# EAGLE design Z80 (EAGLE 7.2.0)
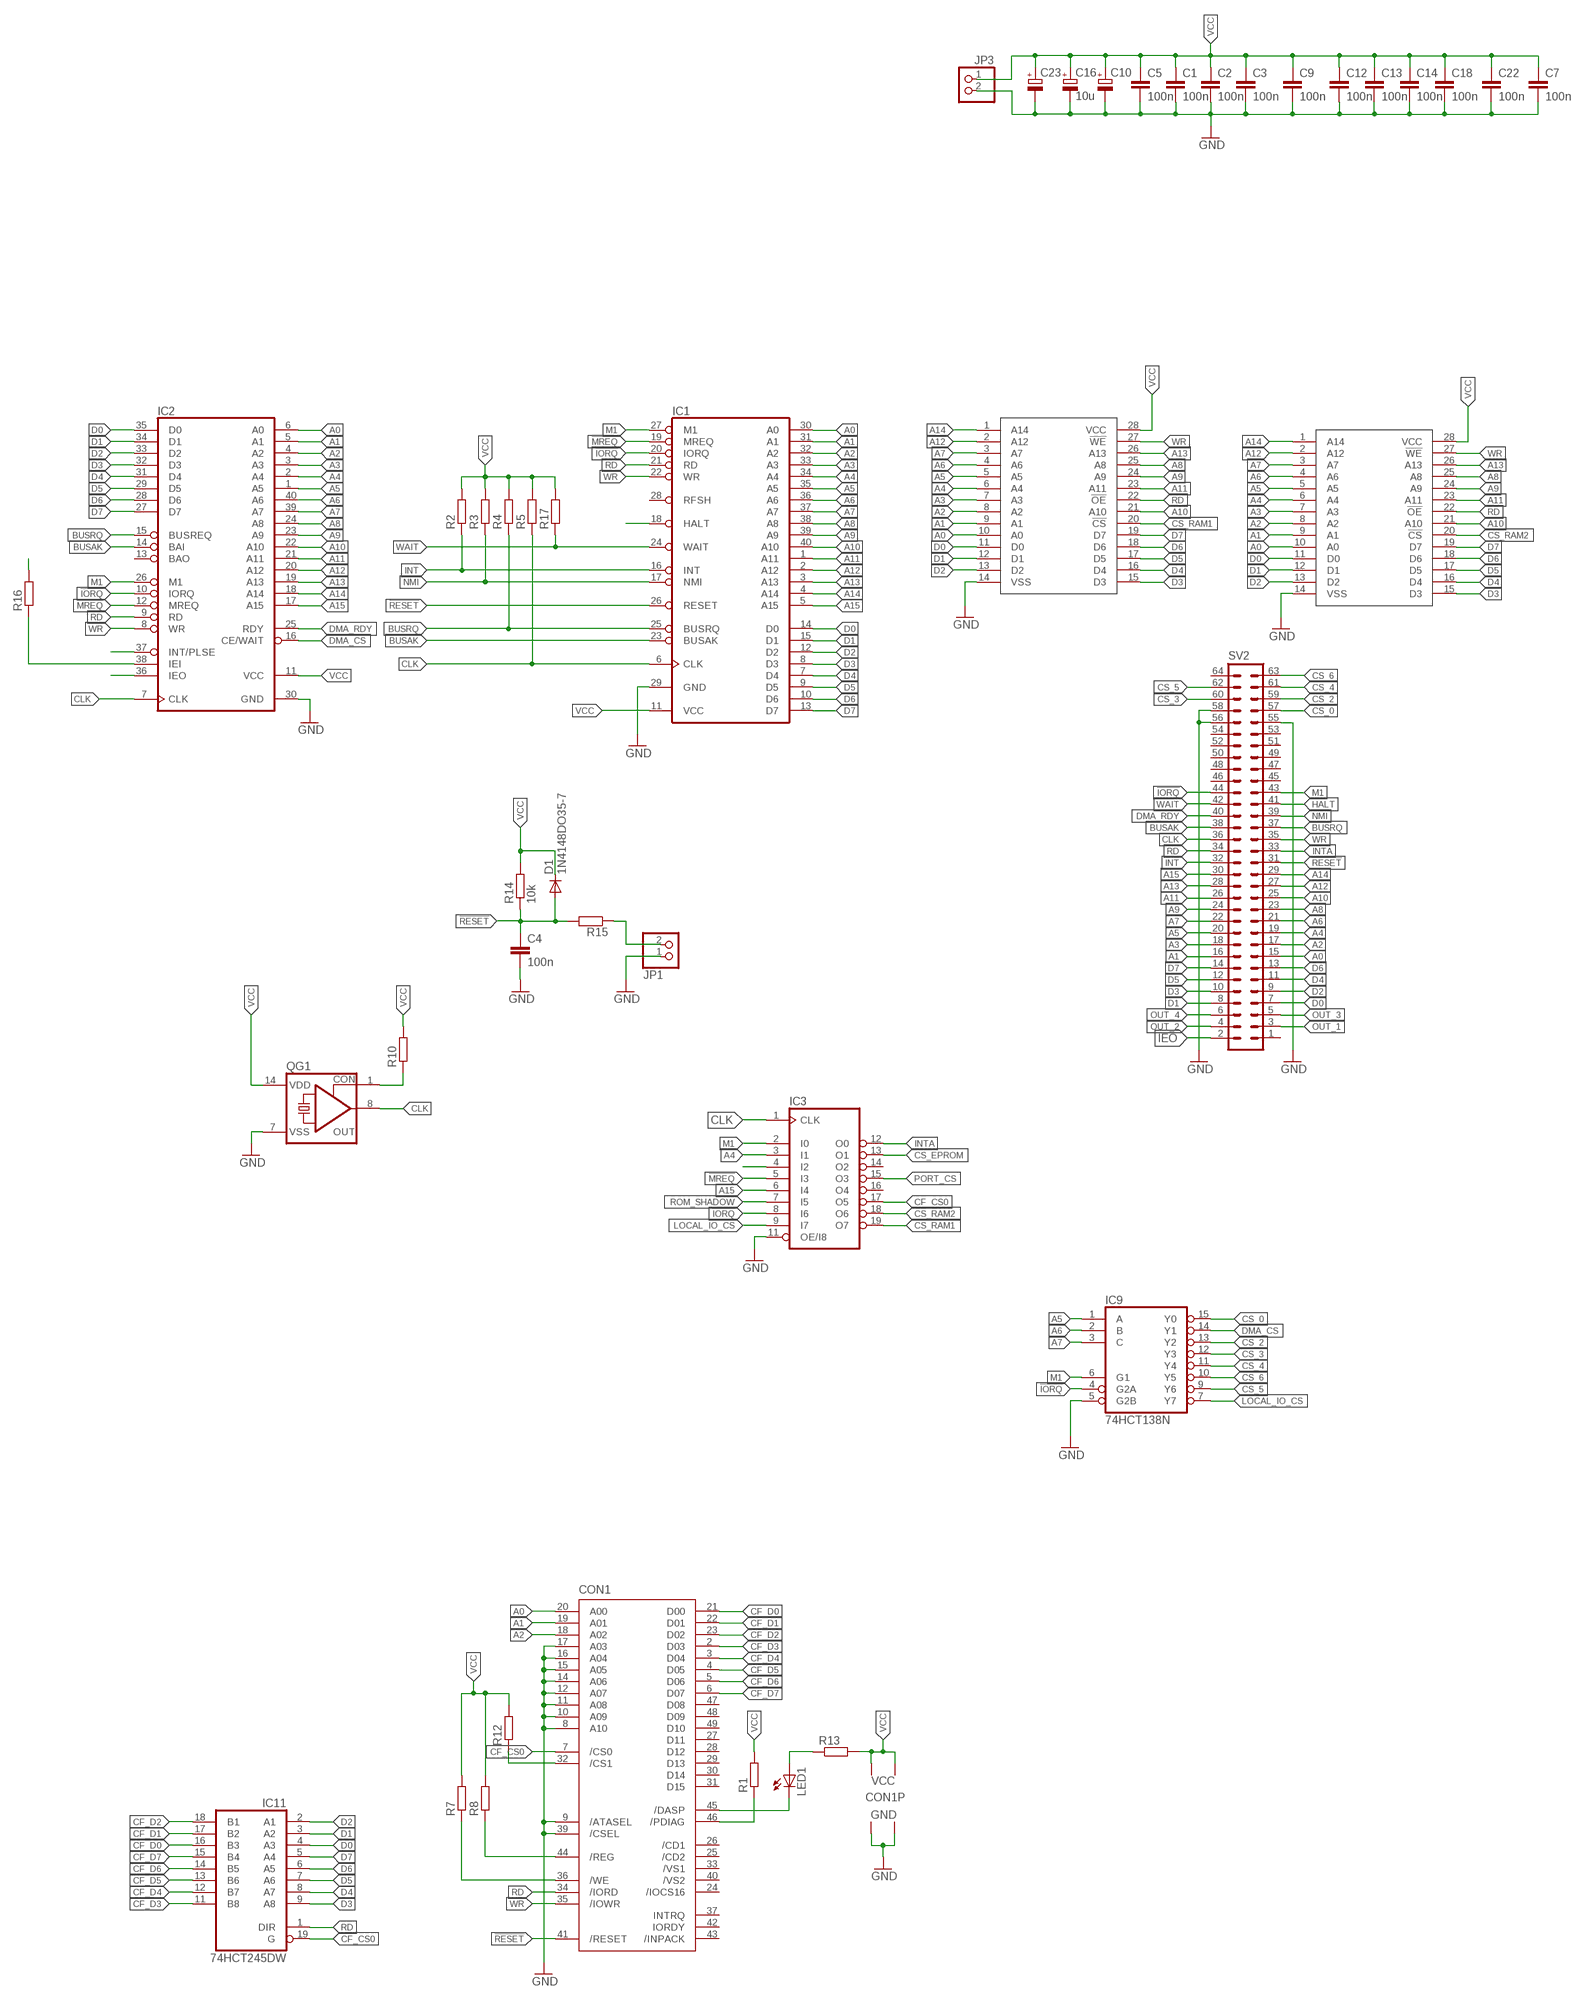
[diagram p0: schematic, sheet 1, part 1 of 2]
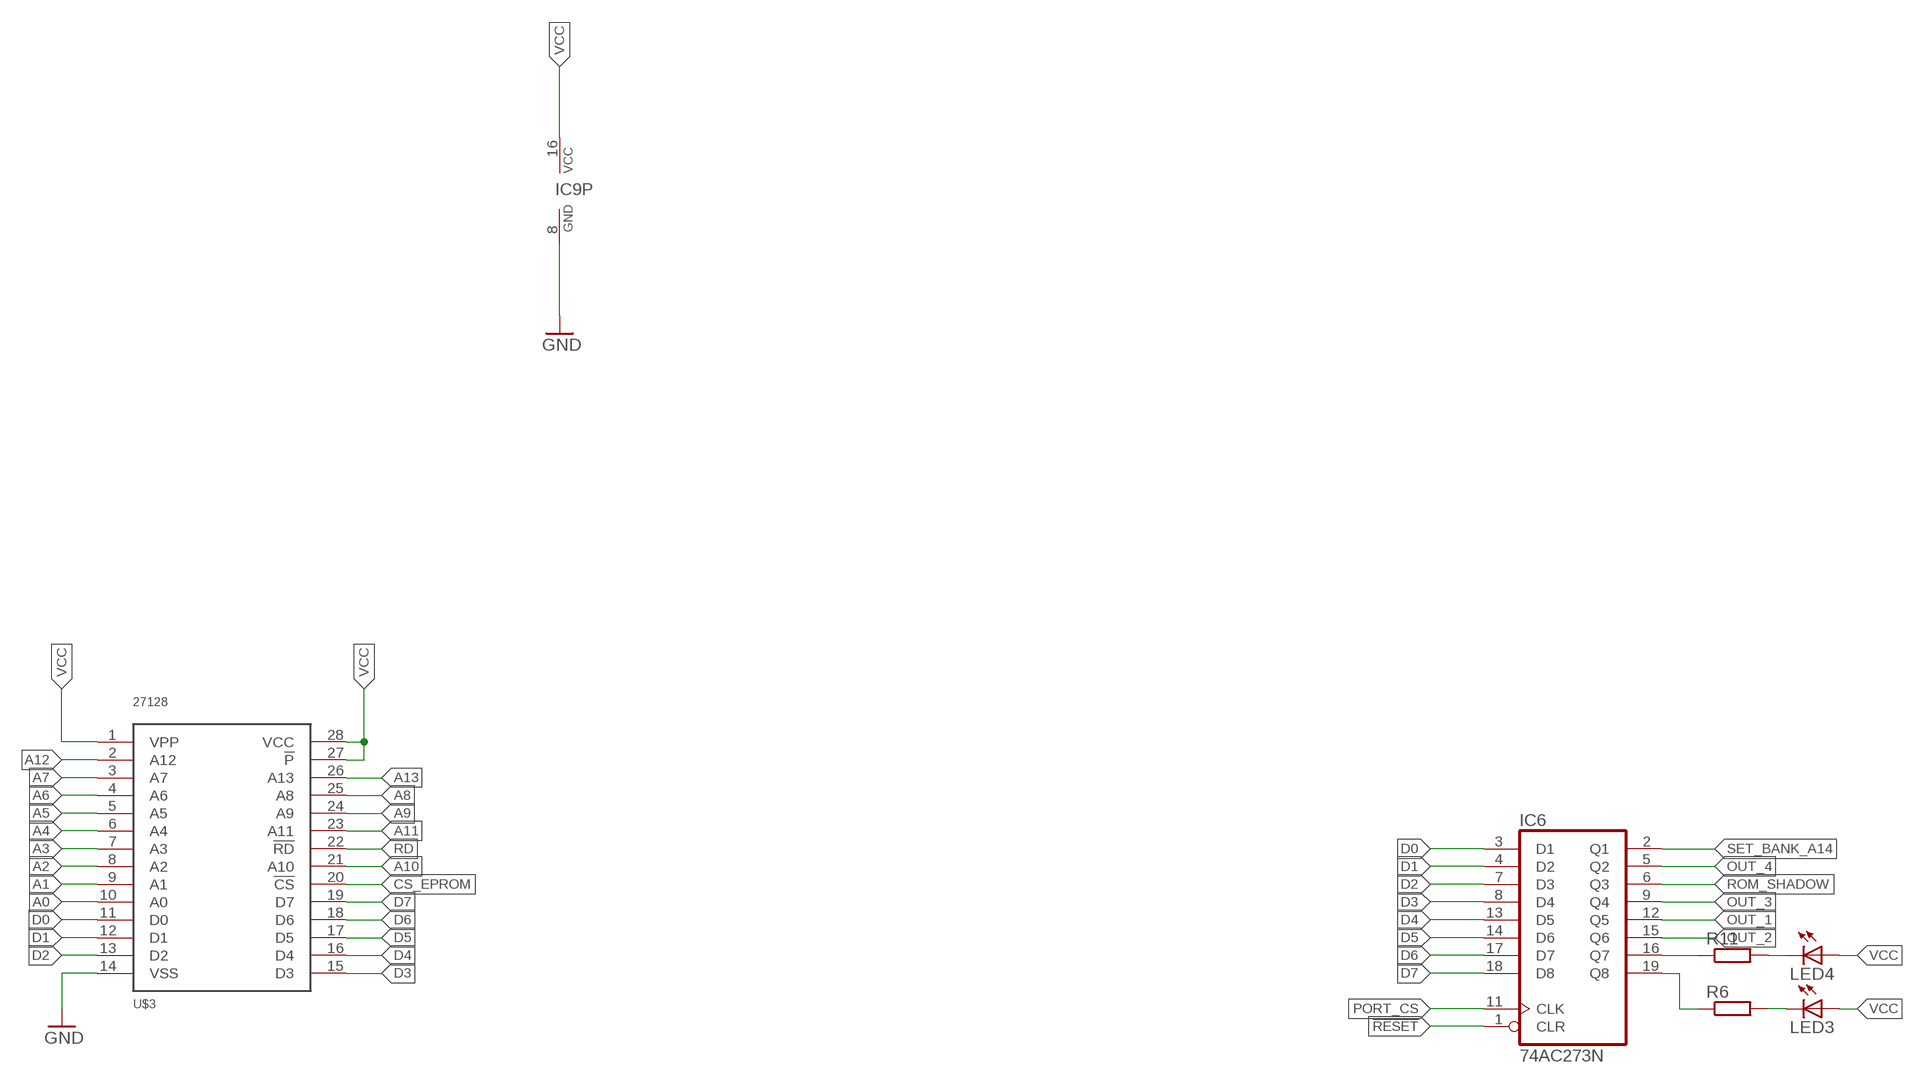
[diagram p1: schematic, sheet 1, part 2 of 2]

## Parts
C1  100n  C-EUC1206  [C1206]
C2  100n  C-EUC1206  [C1206]
C3  100n  C-EUC1206  [C1206]
C4  100n  C-EUC0603  [C0603]
C5  100n  C-EU050-024X044  [C050-024X044]
C7  100n  C-EUC0603  [C0603]
C9  100n  C-EUC1206  [C1206]
C10  CPOL-EUE5-10.5  [E5-10,5]
C12  100n  C-EUC0805  [C0805]
C13  100n  C-EUC0805  [C0805]
C14  100n  C-EUC1206  [C1206]
C16  10u  CPOL-EUSMCB  [SMC_B]
C18  100n  C-EUC0603  [C0603]
C22  100n  C-EUC0603  [C0603]
C23  CPOL-EUE5-10.5  [E5-10,5]
CON1  CF-CARD-IDE_MODE  [MI20-50PD-SF]
D1  1N4148DO35-7  [DO35-7]
IC1  Z80CPU  [DIL40]
IC2  Z80DMA  [DIL40]
IC3  16V8  [DIL20]
IC6  74AC273N  [DIL20]
IC9  74HCT138N  [DIL16]
IC11  74HCT245DW  [SO20W]
JP1  PINHD-1X2  [1X02]
JP3  PINHD-1X2  [1X02]
LED1  LED5MM  [LED5MM]
LED3  LED5MM  [LED5MM]
LED4  LED5MM  [LED5MM]
QG1  CRYSTAL_RES-SG51  [SG51]
R1  R-EU_0204/7  [0204/7]
R2  R-EU_R1206  [R1206]
R3  R-EU_R1206  [R1206]
R4  R-EU_R0603  [R0603]
R5  R-EU_R0603  [R0603]
R6  R-EU_R1206  [R1206]
R7  R-EU_0207/10  [0207/10]
R8  R-EU_0204/7  [0204/7]
R10  R-EU_R0603  [R0603]
R11  R-EU_R1206  [R1206]
R12  R-EU_0207/10  [0207/10]
R13  R-EU_R0603  [R0603]
R14  10k  R-EU_0204/7  [0204/7]
R15  R-EU_R0603  [R0603]
R16  R-EU_0204/5  [0204/5]
R17  R-EU_R0603  [R0603]
SV2  ML64L  [ML64L]
U$2  62256  [DIL28-6]
U$3  27128  [DIL28]
U$4  62256  [DIL28-6]

## Nets
!IORQ: IC1.20(IORQ) IC2.10(IORQ) IC3.8(I6) IC9.4(G2A) SV2.44
!MREQ: IC1.19(MREQ) IC2.12(MREQ) IC3.5(I3)
!RESET: C4.1 CON1.41(/RESET) D1.A IC1.26(RESET) IC6.1(CLR) R14.1 R15.2 SV2.31
A0: CON1.20(A00) IC1.30(A0) IC2.6(A0) SV2.15 U$2.10(A0) U$3.10(A0) U$4.10(A0)
A1: CON1.19(A01) IC1.31(A1) IC2.5(A1) SV2.16 U$2.9(A1) U$3.9(A1) U$4.9(A1)
A2: CON1.18(A02) IC1.32(A2) IC2.4(A2) SV2.17 U$2.8(A2) U$3.8(A2) U$4.8(A2)
A3: IC1.33(A3) IC2.3(A3) SV2.18 U$2.7(A3) U$3.7(A3) U$4.7(A3)
A4: IC1.34(A4) IC2.2(A4) IC3.3(I1) SV2.19 U$2.6(A4) U$3.6(A4) U$4.6(A4)
A5: IC1.35(A5) IC2.1(A5) IC9.1(A) SV2.20 U$2.5(A5) U$3.5(A5) U$4.5(A5)
A6: IC1.36(A6) IC2.40(A6) IC9.2(B) SV2.21 U$2.4(A6) U$3.4(A6) U$4.4(A6)
A7: IC1.37(A7) IC2.39(A7) IC9.3(C) SV2.22 U$2.3(A7) U$3.3(A7) U$4.3(A7)
A8: IC1.38(A8) IC2.24(A8) SV2.23 U$2.25(A8) U$3.25(A8) U$4.25(A8)
A9: IC1.39(A9) IC2.23(A9) SV2.24 U$2.24(A9) U$3.24(A9) U$4.24(A9)
A10: IC1.40(A10) IC2.22(A10) SV2.25 U$2.21(A10) U$3.21(A10) U$4.21(A10)
A11: IC1.1(A11) IC2.21(A11) SV2.26 U$2.23(A11) U$3.23(A11) U$4.23(A11)
A12: IC1.2(A12) IC2.20(A12) SV2.27 U$2.2(A12) U$3.2(A12) U$4.2(A12)
A13: IC1.3(A13) IC2.19(A13) SV2.28 U$2.26(A13) U$3.26(A13) U$4.26(A13)
A14: IC1.4(A14) IC2.18(A14) SV2.29 U$2.1(A14) U$4.1(A14)
A15: IC1.5(A15) IC2.17(A15) IC3.6(I4) SV2.30
BUSAK: IC1.23(BUSAK) IC2.14(BAI) SV2.38
BUSRQ: IC1.25(BUSRQ) IC2.15(BUSREQ) R4.1 SV2.37
CF_CS0: CON1.7(/CS0) IC3.17(O5) IC11.19(G)
CF_D0: CON1.21(D00) IC11.16(B3)
CF_D1: CON1.22(D01) IC11.17(B2)
CF_D2: CON1.23(D02) IC11.18(B1)
CF_D3: CON1.2(D03) IC11.11(B8)
CF_D4: CON1.3(D04) IC11.12(B7)
CF_D5: CON1.4(D05) IC11.13(B6)
CF_D6: CON1.5(D06) IC11.14(B5)
CF_D7: CON1.6(D07) IC11.15(B4)
CLK: IC1.6(CLK) IC2.7(CLK) IC3.1(CLK) QG1.8(OUT) R5.1 SV2.36
CS_0: IC9.15(Y0) SV2.57
CS_2: IC9.13(Y2) SV2.59
CS_3: IC9.12(Y3) SV2.60
CS_4: IC9.11(Y4) SV2.61
CS_5: IC9.9(Y6) SV2.62
CS_6: IC9.10(Y5) SV2.63
CS_EPROM: IC3.13(O1) U$3.20(!CS)
CS_RAM1: IC3.19(O7) U$4.20(!CS)
CS_RAM2: IC3.18(O6) U$2.20(!CS)
D0: IC1.14(D0) IC2.35(D0) IC6.3(D1) IC11.4(A3) SV2.7 U$2.11(D0) U$3.11(D0) U$4.11(D0)
D1: IC1.15(D1) IC2.34(D1) IC6.4(D2) IC11.3(A2) SV2.8 U$2.12(D1) U$3.12(D1) U$4.12(D1)
D2: IC1.12(D2) IC2.33(D2) IC6.7(D3) IC11.2(A1) SV2.9 U$2.13(D2) U$3.13(D2) U$4.13(D2)
D3: IC1.8(D3) IC2.32(D3) IC6.8(D4) IC11.9(A8) SV2.10 U$2.15(D3) U$3.15(D3) U$4.15(D3)
D4: IC1.7(D4) IC2.31(D4) IC6.13(D5) IC11.8(A7) SV2.11 U$2.16(D4) U$3.16(D4) U$4.16(D4)
D5: IC1.9(D5) IC2.29(D5) IC6.14(D6) IC11.7(A6) SV2.12 U$2.17(D5) U$3.17(D5) U$4.17(D5)
D6: IC1.10(D6) IC2.28(D6) IC6.17(D7) IC11.6(A5) SV2.13 U$2.18(D6) U$3.18(D6) U$4.18(D6)
D7: IC1.13(D7) IC2.27(D7) IC6.18(D8) IC11.5(A4) SV2.14 U$2.19(D7) U$3.19(D7) U$4.19(D7)
DMA_CS: IC2.16(CE/WAIT) IC9.14(Y1)
DMA_RDY: IC2.25(RDY) SV2.40
GND: C1.2 C2.2 C3.2 C4.2 C5.2 C7.2 C9.2 C10.- C12.2 C13.2 C14.2 C16.- C18.2 C22.2 C23.- CON1.1(GND1) CON1.8(A10) CON1.9(/ATASEL) CON1.10(A09) CON1.11(A08) CON1.12(A07) CON1.14(A06) CON1.15(A05) CON1.16(A04) CON1.17(A03) CON1.39(/CSEL) CON1.50(GND2) IC1.29(GND) IC2.30(GND) IC3.11(OE/I8) IC9.5(G2B) IC9.8(GND) JP1.1 JP3.2 QG1.7(VSS) SV2.55 SV2.56 SV2.58 U$2.14(VSS) U$3.14(VSS) U$4.14(VSS)
HALT: IC1.18(HALT) SV2.41
IEO: IC2.36(IEO) SV2.2
INT: IC1.16(INT) IC2.37(INT/PLSE) R2.1 SV2.32
INTA: IC3.12(O0) SV2.33
LOCAL_IO_CS: IC3.9(I7) IC9.7(Y7)
M1: IC1.27(M1) IC2.26(M1) IC3.2(I0) IC9.6(G1) SV2.43
N$1: QG1.1(CON) R10.1
N$2: JP1.2 R15.1
N$3: IC2.38(IEI) R16.1
N$5: IC6.16(Q7) R11.1
N$8: LED3.K(C) R6.2
N$9: LED4.K(C) R11.2
N$10: IC6.19(Q8) R6.1
N$11: CON1.44(/REG) R8.1
N$12: CON1.36(/WE) R7.1
N$13: CON1.46(/PDIAG) R1.1
N$15: LED1.A R13.1
N$16: CON1.45(/DASP) LED1.K(C)
N$29: CON1.32(/CS1) R12.1
NMI: IC1.17(NMI) R3.1 SV2.39
OUT_1: IC6.12(Q5) SV2.3
OUT_2: IC6.15(Q6) SV2.4
OUT_3: IC6.9(Q4) SV2.5
OUT_4: IC6.5(Q2) SV2.6
PORT_CS: IC3.15(O3) IC6.11(CLK)
RD: CON1.34(/IORD) IC1.21(RD) IC2.9(RD) IC11.1(DIR) SV2.34 U$2.22(!OE) U$3.22(!RD) U$4.22(!OE)
ROM_SHADOW: IC3.7(I5) IC6.6(Q3)
SET_BANK_A14: IC6.2(Q1)
VCC: C1.1 C2.1 C3.1 C5.1 C7.1 C9.1 C10.+ C12.1 C13.1 C14.1 C16.+ C18.1 C22.1 C23.+ CON1.13(VCC2) CON1.38(VCC1) D1.C IC1.11(VCC) IC2.11(VCC) IC9.16(VCC) JP3.1 LED3.A LED4.A QG1.14(VDD) R1.2 R2.2 R3.2 R4.2 R5.2 R7.2 R8.2 R10.2 R12.2 R13.2 R14.2 R16.2 R17.2 U$2.28(VCC) U$3.1(VPP) U$3.27(!P) U$3.28(VCC) U$4.28(VCC)
WAIT: IC1.24(WAIT) R17.1 SV2.42
WR: CON1.35(/IOWR) IC1.22(WR) IC2.8(WR) IC3.4(I2) SV2.35 U$2.27(!WE) U$4.27(!WE)
Unconnected: CON1.24(/IOCS16) CON1.25(/CD2) CON1.26(/CD1) CON1.27(D11) CON1.28(D12) CON1.29(D13) CON1.30(D14) CON1.31(D15) CON1.33(/VS1) CON1.37(INTRQ) CON1.40(/VS2) CON1.42(IORDY) CON1.43(/INPACK) CON1.47(D08) CON1.48(D09) CON1.49(D10) IC1.28(RFSH) IC2.13(BAO) IC3.14(O2) IC3.16(O4) SV2.1 SV2.45 SV2.46 SV2.47 SV2.48 SV2.49 SV2.50 SV2.51 SV2.52 SV2.53 SV2.54 SV2.64

## Power pins joined to a net without a drawn wire
GND: IC3.10(GND) IC6.10(GND) IC11.10(GND)
VCC: IC3.20(VCC) IC6.20(VCC) IC11.20(VCC)

## Library data of the parts
C1-C5 C7 C9 C12-C14 C18 C22 = rcl:C-EU: CAPACITOR, European symbol
C10 C16 C23 = rcl:CPOL-EU: POLARIZED CAPACITOR, European symbol
CON1 = con-hirose:CF-CARD-IDE_MODE: Compact Flash Adapter Type I or II without Eject Button Source: con-hirose.lbr from Bob Starr <rtzaudio@mindspring.com>; OC_FARNELL: unknown; OC_NEWARK: unknown
D1 = diode:1N4148: DIODE high speed (Philips)
IC1 = zilog:Z80CPU: Z80 FAMILY DEVICE
IC2 = zilog:Z80DMA: Z80 FAMILY DEVICE
IC3 = pal:16V8: PAL; MPN: GAL16V8D-7LPN; OC_FARNELL: 9699740; OC_NEWARK: 97K0449
IC6 = 74xx-eu:74*273: Octal D type FLIP FLOP, clear
IC9 = 74xx-eu:74*138: 3-line to 8-line DECODER/DEMULTIPLEXER
IC11 = 74xx-eu:74*245: Octal BUS TRANSCEIVER, 3-state
JP1 JP3 = pinhead:PINHD-1X2: PIN HEADER
LED1 LED3 LED4 = led:LED: LED OSRAM: - CHIPLED LG R971, LG N971, LY N971, LG Q971, LY Q971, LO R971, LY R971 LH N974, LH R974 LS Q976, LO Q976, LY Q976 LO Q996 - Hyper CHIPLED LW Q18S LB Q993, LB Q99A, LB R99A - SideLED LS A670, LO A670, LY A670, LG A670, LP A670 LB A673, LV A673, LT A673, LW A673 LH A674 LY A675 LS A676, LA A676, LO A676, LY A676, LW A676 LS A679, LY A679, LG A679 - Hyper Micro SIDELED® LS Y876, LA Y876, LO Y876, LY Y876 LT Y87S - SmartLED LW L88C, LW L88S LB L89C, LB L89S, LG L890 LS L89K, LO L89K, LY L89K LS L896, LA L896, LO L896, LY L896 - TOPLED LS T670, LO T670, LY T670, LG T670, LP T670 LSG T670, LSP T670, LSY T670, LOP T670, LYG T670 LG T671, LOG T671, LSG T671 LB T673, LV T673, LT T673, LW T673 LH T674 LS T676, LA T676, LO T676, LY T676, LB T676, LH T676, LSB T676, LW T676 LB T67C, LV T67C, LT T67C, LS T67K, LO T67K, LY T67K, LW E67C LS E67B, LA E67B, LO E67B, LY E67B, LB E67C, LV E67C, LT E67C LW T67C LS T679, LY T679, LG T679 LS T770, LO T770, LY T770, LG T770, LP T770 LB T773, LV T773, LT T773, LW T773 LH T774 LS E675, LA E675, LY E675, LS T675 LS T776, LA T776, LO T776, LY T776, LB T776 LHGB T686 LT T68C, LB T68C - Hyper Mini TOPLED® LB M676 - Mini TOPLED Santana® LG M470 LS M47K, LO M47K, LY M47K Source: http://www.osram.convergy.de LUXEON: - LUMILED® LXK2-PW12-R00, LXK2-PW12-S00, LXK2-PW14-U00, LXK2-PW14-V00 LXK2-PM12-R00, LXK2-PM12-S00, LXK2-PM14-U00 LXK2-PE12-Q00, LXK2-PE12-R00, LXK2-PE12-S00, LXK2-PE14-T00, LXK2-PE14-U00 LXK2-PB12-K00, LXK2-PB12-L00, LXK2-PB12-M00, LXK2-PB14-N00, LXK2-PB14-P00, LXK2-PB14-Q00 LXK2-PR12-L00, LXK2-PR12-M00, LXK2-PR14-Q00, LXK2-PR14-R00 LXK2-PD12-Q00, LXK2-PD12-R00, LXK2-PD12-S00 LXK2-PH12-R00, LXK2-PH12-S00 LXK2-PL12-P00, LXK2-PL12-Q00, LXK2-PL12-R00 Source: www.luxeon.com KINGBRIGHT: KA-3528ASYC Source: www.kingbright.com
QG1 = crystal:CRYSTAL_RES-: CRYSTAL RESONATOR; OC_FARNELL: unknown; OC_NEWARK: unknown
R1-R8 R10-R17 = rcl:R-EU_: RESISTOR, European symbol
SV2 = con-harting-ml:ML64: HARTING; OC_FARNELL: unknown; OC_NEWARK: unknown
U$2 U$4 = memory-sram:62256
U$3 = mw:27128

## Board
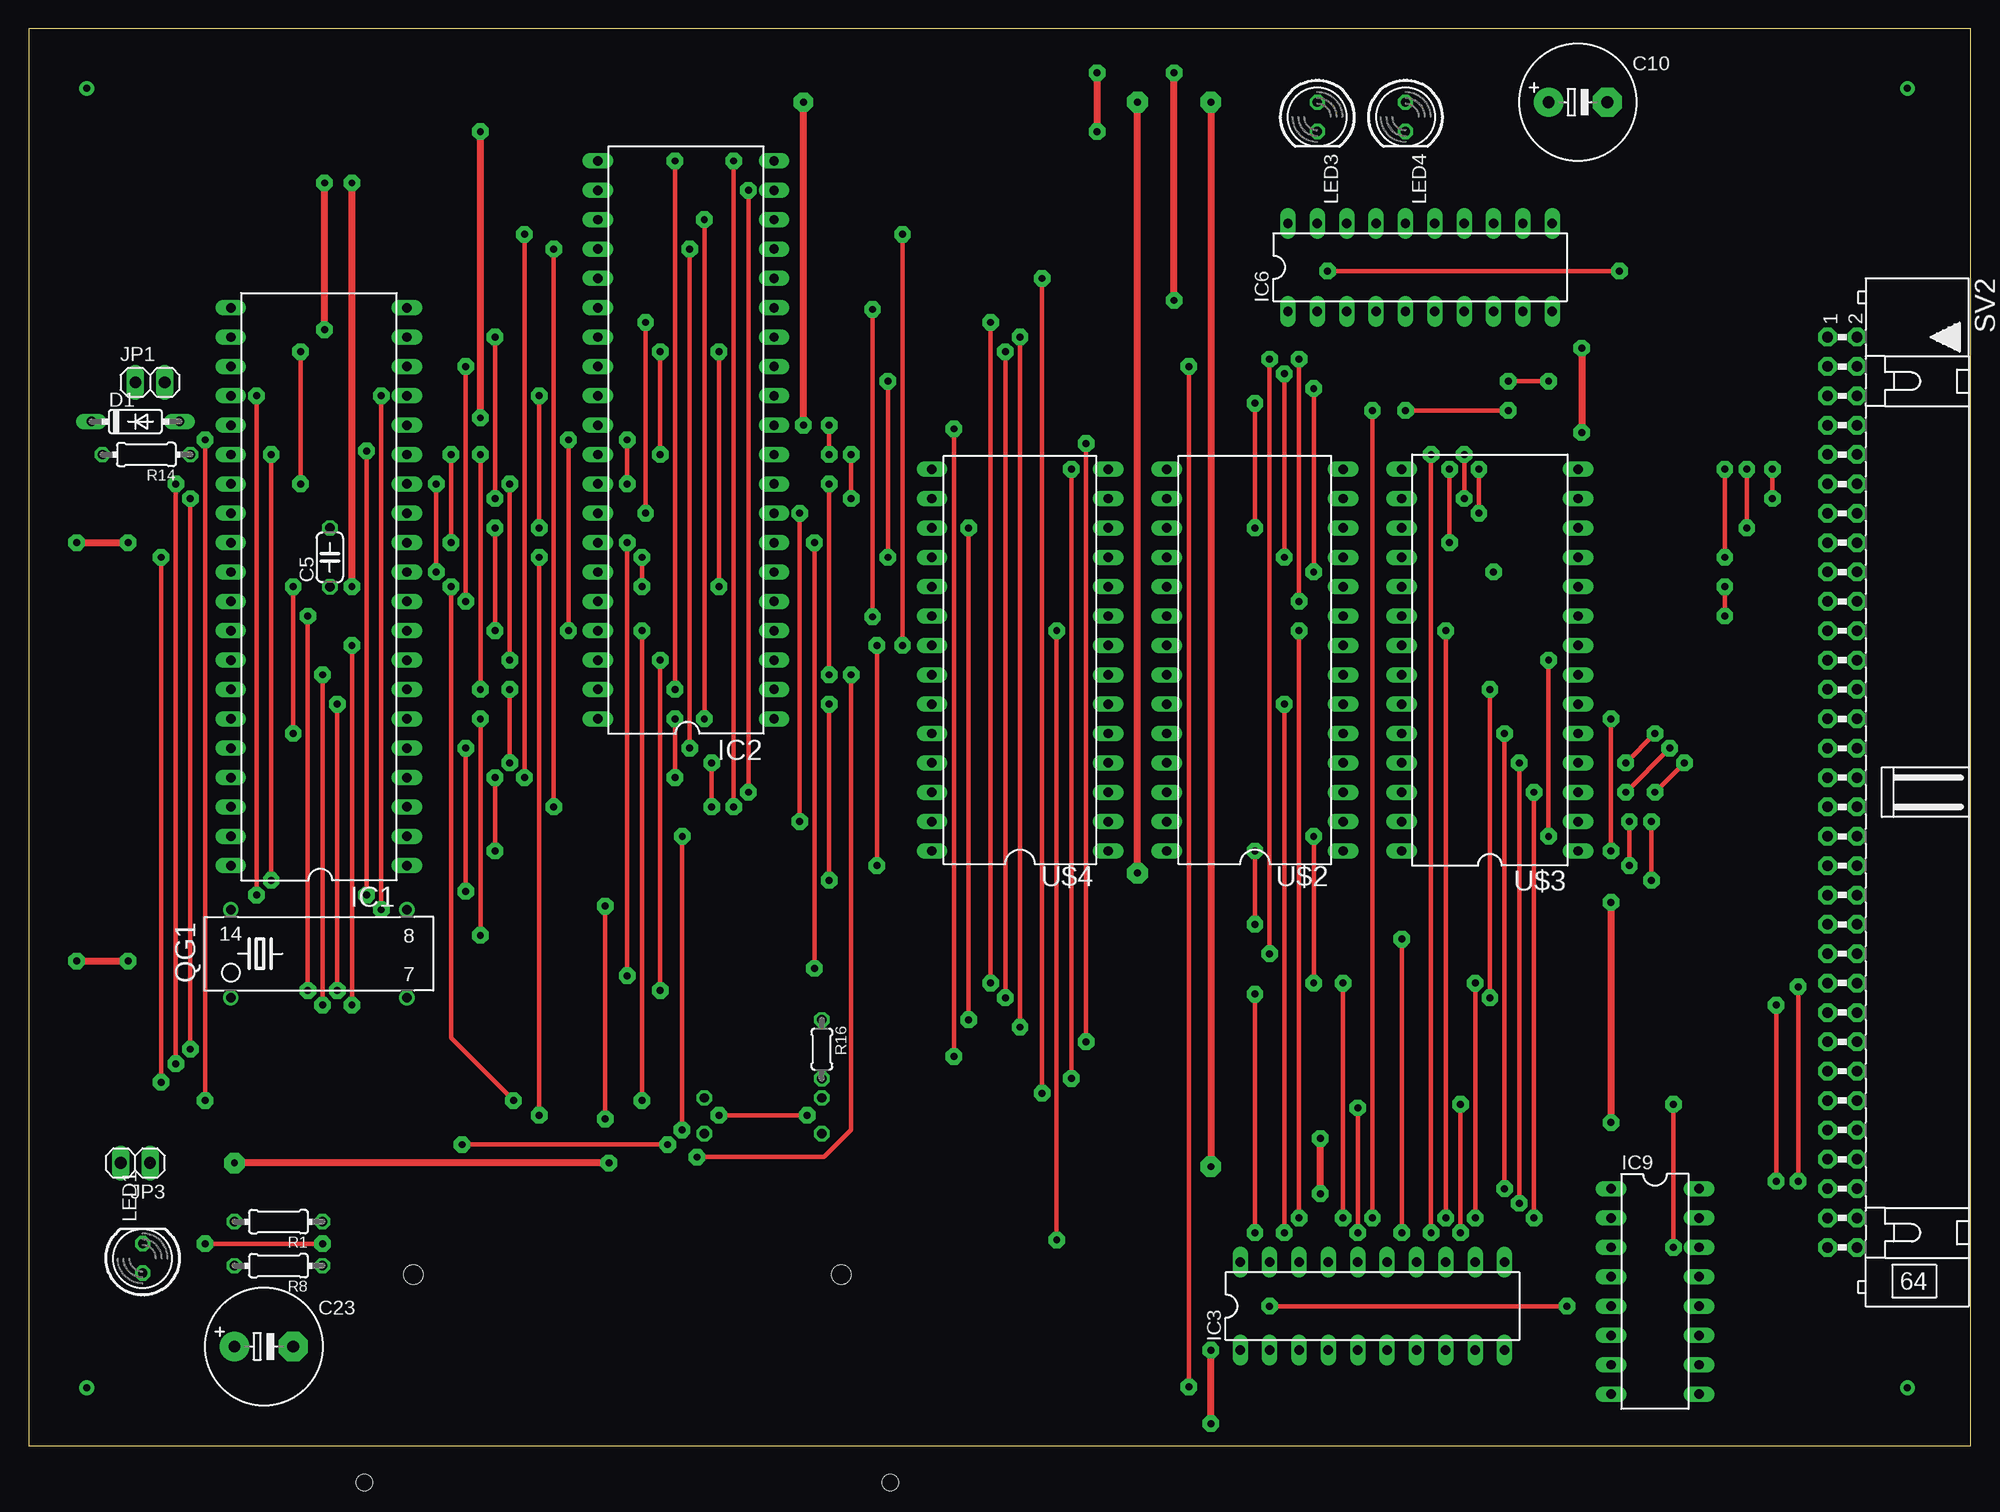
[diagram p2: board, top side]
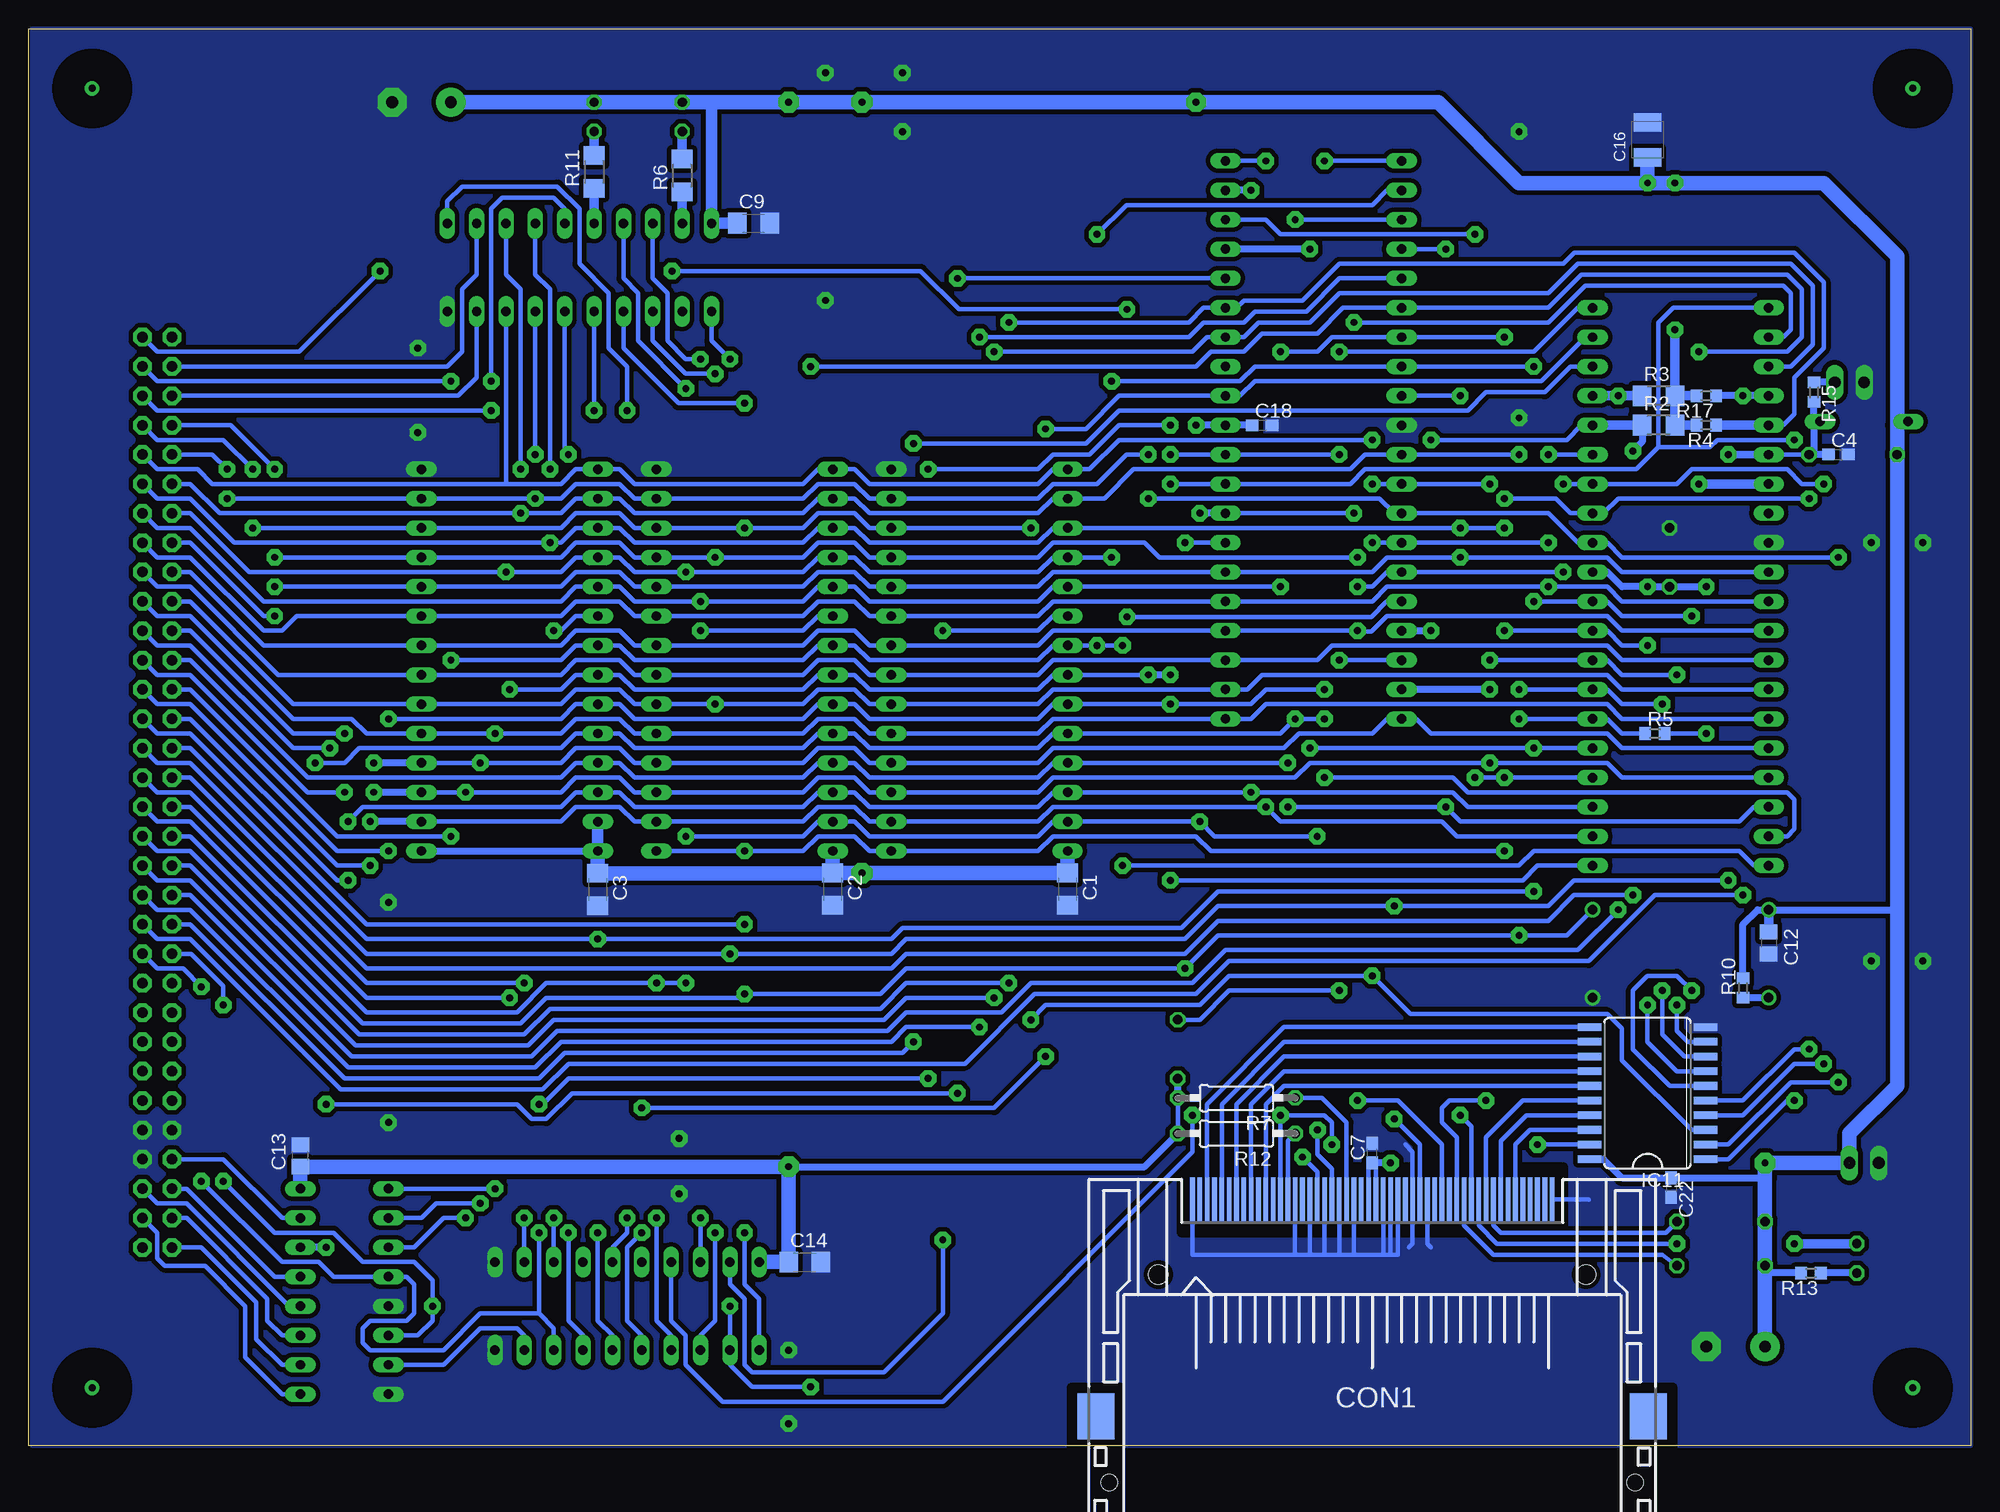
[diagram p3: board, bottom side, seen from below]

Size 167.94 x 122.55 mm. Coordinates in mm from the lower left corner, seen from the top.
Outline: 0,0 167.94,0 167.94,122.55 0,122.55 0,0
Copper layers (1*16): Top 0.035mm / dielectric 1.5mm / Bottom 0.035mm
Design rules "default *": minimum track width 10mil, minimum drill 24mil, track to track 8mil, track to pad 8mil, pad to pad 8mil, via to via 8mil, smd to smd 8mil, copper to edge 0mil, drill to drill 8mil, minimum pad ring 10mil, minimum via ring 8mil, stop-mask expansion 4mil, vias tented up to drill 0mil, thermal gap 10mil
bRestrict: area 2,2 to 8,8; area 2,114.3 to 8,120.4; area 159.4,2 to 165.5,8; area 159.4,114.3 to 165.5,120.4; area 35.2,18.4 to 68.3,24.1

### Footprints (pad centres in the part's own frame; a part is rotated, then mirrored left to right if it is on the bottom)
C1206 = smd 1.6 x 1.8: 1 -1.4,0; 2 1.4,0
C0603 = smd 1.1 x 1: 1 -0.85,0; 2 0.85,0
C050-024X044 = drill 0.813 octagon: 1 -2.54,0; 2 2.54,0
E5-10,5 = drill 1.016 pad 2.54: + -2.54,0 | drill 1.016 pad 2.54 octagon: - 2.54,0
C0805 = smd 1.3 x 1.5: 1 -0.95,0; 2 0.95,0
SMC_B = smd 1.6 x 2.4: + -1.5,0; - 1.5,0
MI20-50PD-SF = smd 0.41 x 3.75: 1 15.557,-18.78; 2 14.287,-18.78; 3 13.018,-18.78; 4 11.748,-18.78; 5 10.477,-18.78; 6 9.207,-18.78; 7 7.938,-18.78; 8 6.668,-18.78; 9 5.397,-18.78; 10 4.128,-18.78; 11 2.857,-18.78; 12 1.587,-18.78; 13 0.318,-18.78; 14 -0.953,-18.78; 15 -2.223,-18.78; 16 -3.493,-18.78; 17 -4.763,-18.78; 18 -6.032,-18.78; 19 -7.303,-18.78; 20 -8.572,-18.78; 21 -9.842,-18.78; 22 -11.113,-18.78; 23 -12.383,-18.78; 24 -13.652,-18.78; 25 -14.922,-18.78; 26 14.922,-18.78; 27 13.652,-18.78; 28 12.383,-18.78; 29 11.113,-18.78; 30 9.842,-18.78; 31 8.572,-18.78; 32 7.303,-18.78; 33 6.032,-18.78; 34 4.763,-18.78; 35 3.493,-18.78; 36 2.223,-18.78; 37 0.953,-18.78; 38 -0.318,-18.78; 39 -1.587,-18.78; 40 -2.857,-18.78; 41 -4.128,-18.78; 42 -5.397,-18.78; 43 -6.668,-18.78; 44 -7.938,-18.78; 45 -9.207,-18.78; 46 -10.477,-18.78; 47 -11.748,-18.78; 48 -13.018,-18.78; 49 -14.287,-18.78; 50 -15.557,-18.78 | smd 3.2 x 4: M1 -23.883,-0.005; M2 23.883,-0.005 | hole 1.676: 18.5,-12.25; -18.5,-12.25 | hole 1.422: -22.75,5.75; 22.75,5.75
DO35-7 = drill 0.813 long: A 3.81,0; C -3.81,0
DIL40 = drill 0.813 long: 1 -24.13,-7.62; 2 -21.59,-7.62; 3 -19.05,-7.62; 4 -16.51,-7.62; 5 -13.97,-7.62; 6 -11.43,-7.62; 7 -8.89,-7.62; 8 -6.35,-7.62; 9 -3.81,-7.62; 10 -1.27,-7.62; 11 1.27,-7.62; 12 3.81,-7.62; 13 6.35,-7.62; 14 8.89,-7.62; 15 11.43,-7.62; 16 13.97,-7.62; 17 16.51,-7.62; 18 19.05,-7.62; 19 21.59,-7.62; 20 24.13,-7.62; 21 24.13,7.62; 22 21.59,7.62; 23 19.05,7.62; 24 16.51,7.62; 25 13.97,7.62; 26 11.43,7.62; 27 8.89,7.62; 28 6.35,7.62; 29 3.81,7.62; 30 1.27,7.62; 31 -1.27,7.62; 32 -3.81,7.62; 33 -6.35,7.62; 34 -8.89,7.62; 35 -11.43,7.62; 36 -13.97,7.62; 37 -16.51,7.62; 38 -19.05,7.62; 39 -21.59,7.62; 40 -24.13,7.62
DIL20 = drill 0.813 long: 1 -11.43,-3.81; 2 -8.89,-3.81; 3 -6.35,-3.81; 4 -3.81,-3.81; 5 -1.27,-3.81; 6 1.27,-3.81; 7 3.81,-3.81; 8 6.35,-3.81; 9 8.89,-3.81; 10 11.43,-3.81; 11 11.43,3.81; 12 8.89,3.81; 13 6.35,3.81; 14 3.81,3.81; 15 1.27,3.81; 16 -1.27,3.81; 17 -3.81,3.81; 18 -6.35,3.81; 19 -8.89,3.81; 20 -11.43,3.81
DIL16 = drill 0.813 long: 1 -8.89,-3.81; 2 -6.35,-3.81; 3 -3.81,-3.81; 4 -1.27,-3.81; 5 1.27,-3.81; 6 3.81,-3.81; 7 6.35,-3.81; 8 8.89,-3.81; 9 8.89,3.81; 10 6.35,3.81; 11 3.81,3.81; 12 1.27,3.81; 13 -1.27,3.81; 14 -3.81,3.81; 15 -6.35,3.81; 16 -8.89,3.81
SO20W = smd 0.66 x 2.032: 1 -5.715,-5.029; 2 -4.445,-5.029; 3 -3.175,-5.029; 4 -1.905,-5.029; 5 -0.635,-5.029; 6 0.635,-5.029; 7 1.905,-5.029; 8 3.175,-5.029; 9 4.445,-5.029; 10 5.715,-5.029; 11 5.715,5.029; 12 4.445,5.029; 13 3.175,5.029; 14 1.905,5.029; 15 0.635,5.029; 16 -0.635,5.029; 17 -1.905,5.029; 18 -3.175,5.029; 19 -4.445,5.029; 20 -5.715,5.029
1X02 = drill 1.016 long: 1 -1.27,0; 2 1.27,0
LED5MM = drill 0.813 octagon: A -1.27,0; K 1.27,0
SG51 = drill 0.813: 1 -7.62,-3.81; 7 7.62,-3.81; 8 7.62,3.81; 14 -7.62,3.81
0204/7 = drill 0.813 octagon: 1 -3.81,0; 2 3.81,0
R1206 = smd 1.6 x 1.803: 1 -1.422,0; 2 1.422,0
R0603 = smd 1 x 1.1: 1 -0.85,0; 2 0.85,0
0207/10 = drill 0.813 octagon: 1 -5.08,0; 2 5.08,0
0204/5 = drill 0.813 octagon: 1 -2.54,0; 2 2.54,0
ML64L = drill 0.914 pad 1.6 octagon: 1 -39.37,-1.27; 2 -39.37,1.27; 3 -36.83,-1.27; 4 -36.83,1.27; 5 -34.29,-1.27; 6 -34.29,1.27; 7 -31.75,-1.27; 8 -31.75,1.27; 9 -29.21,-1.27; 10 -29.21,1.27; 11 -26.67,-1.27; 12 -26.67,1.27; 13 -24.13,-1.27; 14 -24.13,1.27; 15 -21.59,-1.27; 16 -21.59,1.27; 17 -19.05,-1.27; 18 -19.05,1.27; 19 -16.51,-1.27; 20 -16.51,1.27; 21 -13.97,-1.27; 22 -13.97,1.27; 23 -11.43,-1.27; 24 -11.43,1.27; 25 -8.89,-1.27; 26 -8.89,1.27; 27 -6.35,-1.27; 28 -6.35,1.27; 29 -3.81,-1.27; 30 -3.81,1.27; 31 -1.27,-1.27; 32 -1.27,1.27; 33 1.27,-1.27; 34 1.27,1.27; 35 3.81,-1.27; 36 3.81,1.27; 37 6.35,-1.27; 38 6.35,1.27; 39 8.89,-1.27; 40 8.89,1.27; 41 11.43,-1.27; 42 11.43,1.27; 43 13.97,-1.27; 44 13.97,1.27; 45 16.51,-1.27; 46 16.51,1.27; 47 19.05,-1.27; 48 19.05,1.27; 49 21.59,-1.27; 50 21.59,1.27; 51 24.13,-1.27; 52 24.13,1.27; 53 26.67,-1.27; 54 26.67,1.27; 55 29.21,-1.27; 56 29.21,1.27; 57 31.75,-1.27; 58 31.75,1.27; 59 34.29,-1.27; 60 34.29,1.27; 61 36.83,-1.27; 62 36.83,1.27; 63 39.37,-1.27; 64 39.37,1.27
DIL28-6 = drill 0.813 long: 1 -16.51,-7.62; 2 -13.97,-7.62; 3 -11.43,-7.62; 4 -8.89,-7.62; 5 -6.35,-7.62; 6 -3.81,-7.62; 7 -1.27,-7.62; 8 1.27,-7.62; 9 3.81,-7.62; 10 6.35,-7.62; 11 8.89,-7.62; 12 11.43,-7.62; 13 13.97,-7.62; 14 16.51,-7.62; 15 16.51,7.62; 16 13.97,7.62; 17 11.43,7.62; 18 8.89,7.62; 19 6.35,7.62; 20 3.81,7.62; 21 1.27,7.62; 22 -1.27,7.62; 23 -3.81,7.62; 24 -6.35,7.62; 25 -8.89,7.62; 26 -11.43,7.62; 27 -13.97,7.62; 28 -16.51,7.62
DIL28 = drill 0.813 long: 1 -16.51,-7.62; 2 -13.97,-7.62; 3 -11.43,-7.62; 4 -8.89,-7.62; 5 -6.35,-7.62; 6 -3.81,-7.62; 7 -1.27,-7.62; 8 1.27,-7.62; 9 3.81,-7.62; 10 6.35,-7.62; 11 8.89,-7.62; 12 11.43,-7.62; 13 13.97,-7.62; 14 16.51,-7.62; 15 16.51,7.62; 16 13.97,7.62; 17 11.43,7.62; 18 8.89,7.62; 19 6.35,7.62; 20 3.81,7.62; 21 1.27,7.62; 22 -1.27,7.62; 23 -3.81,7.62; 24 -6.35,7.62; 25 -8.89,7.62; 26 -11.43,7.62; 27 -13.97,7.62; 28 -16.51,7.62

### Placement (x,y rotation side)
C1  78.11,48.13 270 bottom
C2  98.42,48.13 270 bottom
C3  118.75,48.11 270 bottom
C4  11.43,85.72 0 bottom
C5  26.04,76.83 90 top
C7  51.75,25.3 90 bottom
C9  105.27,105.73 0 bottom
C10  133.99,116.2 0 top
C12  17.46,43.5 270 bottom
C13  144.46,25.08 90 bottom
C14  100.84,15.88 0 bottom
C16  27.94,112.94 90 bottom
C18  61.28,88.27 0 bottom
C22  25.9,22.31 270 bottom
C23  20.32,8.57 0 top
CON1  51.75,2.54 180 bottom
D1  9.21,88.58 0 top
IC1  25.08,74.3 90 top
IC2  56.83,87 90 top
IC3  116.2,12.06 0 top
IC6  120.33,101.92 0 top
IC9  140.65,13.34 270 top
IC11  27.94,30.48 90 bottom
JP1  10.48,91.97 0 top
JP3  9.21,24.45 180 top
LED1  9.84,16.19 90 top
LED3  111.44,114.94 270 top
LED4  119.06,114.94 270 top
QG1  25.08,42.55 0 top
R1  21.59,19.37 180 top
R2  26.99,88.27 0 bottom
R3  26.99,90.81 0 bottom
R4  22.86,88.27 180 bottom
R5  27.3,61.59 0 bottom
R6  111.44,109.86 90 bottom
R7  63.5,30.07 180 bottom
R8  21.59,15.56 180 top
R10  19.68,39.59 90 bottom
R11  119.06,110.17 90 bottom
R12  63.5,26.99 180 bottom
R13  13.8,14.92 180 bottom
R14  10.16,85.72 180 top
R15  13.55,91.12 270 bottom
R16  68.58,34.29 270 top
R17  22.86,90.81 180 bottom
SV2  156.84,56.52 270 top
U$2  106.05,67.94 90 top
U$3  126.36,67.94 90 top
U$4  85.72,67.94 90 top

### Tracks (layer width: path | path; a pad name or v marks a point on that pad's centre or on a via)
!IORQ  (via drill 0.6 pad 1.42)
  Top 0.406: v54.61,94.61 v54.61,85.72 | v69.22,85.72 v69.22,88.27 | v90.17,84.45 v90.17,31.75 | v123.83,29.53 v123.83,18.41 | v153.03,22.86 v153.03,39.69
  Bottom 0.406: IC1.20 33.97,98.42 37.78,94.61 v54.61,94.61 | v54.61,85.72 IC2.10 v69.22,85.72 | v69.22,88.27 73.66,88.27 76.2,85.72 79.38,85.72 80.64,84.45 v90.17,84.45 | v90.17,31.75 121.28,31.75 123.51,29.53 v123.83,29.53 | IC3.8 122.56,10.16 123.83,11.43 | 123.83,11.43 128.91,11.43 132.08,8.26 138.43,8.26 139.06,8.89 139.06,10.16 138.43,10.79 135.25,10.79 134.62,11.43 134.62,13.97 135.25,14.61 IC9.4 141.6,14.61 142.88,15.88 146.05,15.88 v153.03,22.86 | v123.83,18.41 123.83,11.43 | SV2.44 156.84,41.27 154.62,41.27 v153.03,39.69
!MREQ  (via drill 0.6 pad 1.42)
  Top 0.406: v80.01,87.95 v80.01,33.66 | v114.94,29.21 v114.94,18.41
  Bottom 0.406: v80.01,87.95 76.52,87.95 73.66,90.81 IC2.12 63.18,90.81 61.91,92.08 37.15,92.08 33.34,95.89 IC1.19 | v114.94,29.21 84.45,29.21 v80.01,33.66 | IC3.5 114.94,9.53 116.2,10.79 116.2,17.14 v114.94,18.41
!RESET  (via drill 0.6 pad 1.42)
  Top 0.406: v20.95,48.9 v20.95,85.72 | v107.31,93.98 v107.31,42.55 | v49.85,46.67 v49.85,28.26
  Bottom 0.406: SV2.31 153.99,57.78 138.75,42.55 v107.31,42.55 93.34,42.55 92.08,43.81 67.94,43.81 65.09,46.67 v49.85,46.67 36.52,46.67 34.3,48.9 v20.95,48.9 | IC6.1 108.9,95.57 v107.31,93.98 | CON1.41 47.62,26.04 v49.85,28.26 | R14.1 IC1.26
  Bottom 0.61: C4.1 13.34,85.72 | 13.34,85.72 R14.1 | D1.A 13.55,88.58 | 13.55,88.58 R15.2 | 13.55,88.58 13.55,85.94 13.34,85.72
  Bottom 0.635: IC1.26 v20.95,85.72
A0  (via drill 0.6 pad 1.42)
  Top 0.406: v146.69,74.3 v146.69,71.75 | v44.13,28.57 v44.13,76.83
  Bottom 0.406: U$3.10 v146.69,74.3 121.92,74.3 120.65,75.56 116.84,75.56 115.57,74.3 U$2.10 100.97,74.3 99.69,75.56 96.52,75.56 95.25,74.3 U$4.10 80.64,74.3 79.38,75.56 IC2.6 51.75,75.56 50.48,76.83 v44.13,76.83 31.43,76.83 30.16,75.56 IC1.30 | SV2.15 153.99,78.11 147.64,71.75 v146.69,71.75 | CON1.20 43.18,27.62 v44.13,28.57
A1  (via drill 0.6 pad 1.42)
  Top 0.406: v36.51,74.3 36.51,35.24 v41.91,29.84
  Bottom 0.406: SV2.16 156.84,76.83 153.99,76.83 147.64,70.48 146.05,70.48 144.78,71.75 U$3.9 121.92,71.75 120.65,73.03 116.84,73.03 115.57,71.75 U$2.9 100.97,71.75 99.69,73.03 96.52,73.03 95.25,71.75 U$4.9 80.64,71.75 79.38,73.03 IC2.5 51.75,73.03 50.48,74.3 v36.51,74.3 31.43,74.3 30.16,73.03 IC1.31 | CON1.19 44.45,26.67 45.72,27.94 45.72,29.21 45.09,29.84 v41.91,29.84
A2  (via drill 0.6 pad 1.42)
  Top 0.406: v53.02,70.48 v53.02,29.84
  Bottom 0.406: SV2.17 153.99,75.56 147.64,69.22 U$3.8 121.92,69.22 120.65,70.48 116.84,70.48 115.57,69.22 U$2.8 100.97,69.22 99.69,70.48 96.52,70.48 95.25,69.22 U$4.8 80.64,69.22 79.38,70.48 IC2.4 v53.02,70.48 52.95,70.41 51.85,70.41 50.5,71.75 31.43,71.75 30.16,70.48 IC1.32 | CON1.18 45.72,26.04 49.53,29.84 v53.02,29.84
A3
  Bottom 0.406: SV2.18 156.84,74.3 153.99,74.3 146.37,66.67 U$3.7 121.92,66.67 120.65,67.94 116.84,67.94 115.57,66.67 U$2.7 100.97,66.67 99.69,67.94 96.52,67.94 95.25,66.67 U$4.7 80.64,66.67 79.38,67.94 IC2.3 56.52,67.94 55.24,69.22 31.43,69.22 30.16,67.94 IC1.33
A4  (via drill 0.6 pad 1.42)
  Top 0.406: v108.58,64.14 v108.58,18.41
  Bottom 0.406: SV2.19 153.99,73.03 145.1,64.14 U$3.6 121.92,64.14 120.65,65.41 116.84,65.41 115.57,64.14 U$2.6 v108.58,64.14 100.97,64.14 99.69,65.41 96.52,65.41 95.25,64.14 U$4.6 80.64,64.14 79.38,65.41 IC2.2 62.55,65.41 61.28,66.67 31.43,66.67 30.16,65.41 IC1.34 | v108.58,18.41 108.58,10.79 109.86,9.53 IC3.3
A5  (via drill 0.6 pad 1.42)
  Top 0.406: v127.64,22.23 v127.64,61.59
  Bottom 0.406: v127.64,61.59 121.92,61.59 120.65,62.87 116.84,62.87 115.57,61.59 U$2.5 100.97,61.59 99.69,62.87 96.52,62.87 95.25,61.59 U$4.5 80.64,61.59 79.38,62.87 IC2.1 62.23,62.87 60.96,64.14 31.43,64.14 30.16,62.87 IC1.35 | v127.64,61.59 U$3.5 138.75,61.59 140.02,62.87 145.1,62.87 153.99,71.75 156.84,71.75 SV2.20 | v127.64,61.59 123.83,61.59 | v127.64,22.23 IC9.1
A6  (via drill 0.6 pad 1.42)
  Top 0.406: v138.11,59.05 v140.65,61.59 | v128.91,20.95 v128.91,59.05
  Bottom 0.406: v128.91,59.05 121.92,59.05 120.65,60.33 116.84,60.33 115.57,59.05 U$2.4 100.97,59.05 99.69,60.33 96.52,60.33 95.25,59.05 U$4.4 80.64,59.05 79.38,60.33 59.37,60.33 58.1,61.59 51.75,61.59 50.48,62.87 IC2.40 47.94,62.87 46.67,61.59 31.43,61.59 30.16,60.33 IC1.36 | v128.91,59.05 U$3.4 | SV2.21 153.99,70.48 145.1,61.59 v140.65,61.59 | v128.91,59.05 125.09,59.05 | v128.91,20.95 132.72,20.95 133.99,19.68 IC9.2
  Bottom 0.61: U$3.4 v138.11,59.05
A7  (via drill 0.6 pad 1.42)
  Top 0.406: v138.11,56.52 v141.92,60.33 | v130.18,19.68 v130.18,56.52 | v41.59,59.05 v41.59,65.41
  Bottom 0.406: U$3.3 v130.18,56.52 121.92,56.52 120.65,57.78 116.84,57.78 115.57,56.52 U$2.3 100.97,56.52 99.69,57.78 96.52,57.78 95.25,56.52 U$4.3 80.64,56.52 79.38,57.78 58.42,57.78 57.15,59.05 v41.59,59.05 31.43,59.05 30.16,57.78 IC1.37 | SV2.22 156.84,69.22 153.99,69.22 145.1,60.33 v141.92,60.33 | IC9.3 134.62,17.14 132.08,19.68 v130.18,19.68
  Bottom 0.61: U$3.3 v138.11,56.52 | v41.59,65.41 IC2.39
A8  (via drill 0.6 pad 1.42)
  Top 0.406: v59.05,59.05 v59.05,55.24 | v45.4,55.24 v45.4,103.5
  Bottom 0.406: SV2.23 153.99,67.94 143.83,57.78 121.92,57.78 120.65,59.05 U$3.25 116.84,59.05 115.57,57.78 100.97,57.78 99.69,59.05 U$2.25 96.52,59.05 95.25,57.78 80.64,57.78 79.38,59.05 U$4.25 v59.05,59.05 | IC1.38 18.73,55.24 20,53.98 44.13,53.98 v45.4,55.24 v59.05,55.24 | v45.4,103.5 IC2.24
A9  (via drill 0.6 pad 1.42)
  Top 0.406: v143.19,59.05 v140.65,56.52 | v58.42,62.87 v58.42,106.05 | v55.88,62.87 v55.88,57.78
  Bottom 0.406: SV2.24 156.84,66.67 153.99,66.67 143.83,56.52 v140.65,56.52 | v143.19,59.05 140.65,59.05 139.38,60.33 121.92,60.33 120.65,61.59 U$3.24 116.84,61.59 115.57,60.33 100.97,60.33 99.69,61.59 U$2.24 96.52,61.59 95.25,60.33 80.64,60.33 79.38,61.59 U$4.24 59.69,61.59 v58.42,62.87 v55.88,62.87 | v58.42,106.05 IC2.23 | IC1.39 15.88,52.7 15.24,53.34 15.24,55.88 15.88,56.52 43.5,56.52 44.77,57.78 v55.88,57.78
A10  (via drill 0.6 pad 1.42)
  Top 0.406: v131.44,67.94 v131.44,52.7 | v73.34,50.16 v73.34,69.22 | v75.56,69.22 v75.56,104.78
  Bottom 0.406: v131.44,67.94 121.92,67.94 120.65,69.22 U$3.21 116.84,69.22 115.57,67.94 100.97,67.94 99.69,69.22 U$2.21 96.52,69.22 95.25,67.94 80.64,67.94 79.38,69.22 U$4.21 v75.56,69.22 v73.34,69.22 | v131.44,52.7 141.29,52.7 153.99,65.41 SV2.25 | IC2.22 50.48,108.58 51.75,107.31 73.03,107.31 v75.56,104.78 | IC1.40 18.73,50.16 20,51.44 37.78,51.44 39.05,50.16 v73.34,50.16
A11  (via drill 0.6 pad 1.42)
  Top 0.406: v136.84,62.87 v136.84,51.44 | v55.88,65.41 v55.88,111.12 | v69.22,64.14 v69.22,48.9
  Bottom 0.406: SV2.26 156.84,64.14 153.99,64.14 141.29,51.44 v136.84,51.44 | v136.84,62.87 121.92,62.87 120.65,64.14 U$3.23 116.84,64.14 115.57,62.87 100.97,62.87 99.69,64.14 U$2.23 96.52,64.14 95.25,62.87 80.64,62.87 79.38,64.14 U$4.23 v69.22,64.14 62.23,64.14 60.96,65.41 v55.88,65.41 | v55.88,111.12 IC2.21 | IC1.1 37.46,50.16 38.73,48.9 v69.22,48.9
A12  (via drill 0.6 pad 1.42)
  Top 0.406: v138.43,53.98 v138.43,50.16 | v60.96,55.24 v60.96,111.12
  Bottom 0.406: U$3.2 121.92,53.98 120.65,55.24 116.84,55.24 115.57,53.98 U$2.2 100.97,53.98 99.69,55.24 96.52,55.24 95.25,53.98 U$4.2 80.64,53.98 79.38,55.24 v60.96,55.24 59.69,53.98 45.72,53.98 44.45,52.7 IC1.2 | v138.43,50.16 141.29,50.16 153.99,62.87 SV2.27 | v60.96,111.12 IC2.20
  Bottom 0.61: U$3.2 v138.43,53.98
A13  (via drill 0.6 pad 1.42)
  Top 0.406: v140.34,53.98 v140.34,48.9 | v62.23,56.52 v62.23,108.58
  Bottom 0.406: SV2.28 156.84,61.59 153.99,61.59 141.29,48.9 v140.34,48.9 | v140.34,53.98 139.06,55.24 121.92,55.24 120.65,56.52 U$3.26 116.84,56.52 115.57,55.24 100.97,55.24 99.69,56.52 U$2.26 96.52,56.52 95.25,55.24 80.64,55.24 79.38,56.52 U$4.26 v62.23,56.52 44.77,56.52 43.5,55.24 IC1.3
  Bottom 0.61: v62.23,108.58 IC2.19
A14  (via drill 0.6 pad 1.42)
  Top 0.406: v40.32,51.44 v40.32,57.78 | v106.05,45.09 v106.05,51.44 | v42.86,57.78 v42.86,104.78
  Bottom 0.406: SV2.29 153.99,60.33 138.75,45.09 v106.05,45.09 | IC1.4 v40.32,57.78 v42.86,57.78 | v40.32,51.44 65.72,51.44 66.99,52.7 79.38,52.7 80.64,51.44 U$4.1 95.25,51.44 96.52,52.7 99.69,52.7 100.97,51.44 v106.05,51.44 U$2.1 | v42.86,104.78 59.69,104.78 60.96,106.05 IC2.18
A15  (via drill 0.6 pad 1.42)
  Top 0.406: v118.75,18.41 v118.75,43.81 | v37.78,60.33 v37.78,47.94 | v57.15,60.33 v57.15,103.5
  Bottom 0.406: SV2.30 156.84,59.05 153.99,59.05 138.75,43.81 v118.75,43.81 93.34,43.81 92.39,44.77 68.26,44.77 65.09,47.94 v37.78,47.94 | IC1.5 v37.78,60.33 v57.15,60.33 | v118.75,18.41 118.75,10.79 117.47,9.53 IC3.6
  Bottom 0.61: v57.15,103.5 IC2.17
BUSAK  (via drill 0.6 pad 1.42)
  Top 0.406: v84.45,94.61 v84.45,38.73
  Bottom 0.406: SV2.38 156.84,48.9 153.99,48.9 139.7,34.61 124.78,34.61 122.56,36.83 93.98,36.83 92.08,38.73 v84.45,38.73 | IC1.23 15.56,93.34 13.65,95.25 13.65,100.33 15.56,102.23 33.97,102.23 36.51,99.69 54.61,99.69 57.15,97.16 61.59,97.16 62.87,95.89 IC2.14 66.04,95.89 67.31,94.61 v84.45,94.61
BUSRQ  (via drill 0.6 pad 1.42)
  Top 0.406: v83.19,97.16 v83.19,40.01
  Bottom 0.406: SV2.37 153.99,50.16 139.38,35.56 125.09,35.56 122.87,37.78 94.3,37.78 92.08,40.01 v83.19,40.01 | IC1.25 16.19,88.27 15.24,89.22 15.24,92.39 12.7,94.93 12.7,100.65 15.24,103.19 34.29,103.19 35.24,102.23 54.61,102.23 57.78,99.06 62.87,99.06 63.5,98.42 IC2.15 66.36,98.42 67.63,97.16 v83.19,97.16
  Bottom 0.813: IC1.25 R4.1
CF_CS0  (via drill 0.6 pad 1.42)
  Top 0.406: v59.69,28.57 v67.31,28.57 | v37.47,26.04 v55.24,26.04
  Bottom 0.406: CON1.7 v59.69,28.57 55.88,28.57 55.24,27.94 v55.24,26.04 | v67.31,28.57 67.31,25.4 88.9,3.81 107.95,3.81 111.12,6.99 111.12,9.53 112.39,10.79 IC3.17 | IC11.19 v37.47,26.04
CF_D0
  Bottom 0.406: CON1.21 41.91,26.67 38.73,29.84 IC11.16
CF_D1
  Bottom 0.406: CON1.22 40.64,26.35 38.42,28.57 IC11.17
CF_D2
  Bottom 0.406: CON1.23 39.37,26.04 38.1,27.3 IC11.18
CF_D3
  Bottom 0.406: CON1.2 66.04,29.53 59.37,36.2 IC11.11
CF_D4
  Bottom 0.406: CON1.3 64.77,29.53 59.37,34.92 IC11.12
CF_D5
  Bottom 0.406: CON1.4 63.5,29.53 59.37,33.66 IC11.13
CF_D6
  Bottom 0.406: CON1.5 62.23,29.53 59.37,32.38 IC11.14
CF_D7
  Bottom 0.406: CON1.6 60.96,29.53 59.37,31.11 IC11.15
CLK  (via drill 0.6 pad 1.42)
  Top 0.406: v67.94,78.11 v67.94,41.27 | v39.05,62.87 v39.05,44.13 | v106.05,39.05 v106.05,18.41
  Bottom 0.406: SV2.36 156.84,51.44 153.99,51.44 139.06,36.51 125.41,36.51 123.19,38.73 106.36,38.73 v106.05,39.05 94.3,39.05 92.08,41.27 v67.94,41.27 65.09,44.13 v39.05,44.13 34.92,44.13 QG1.8 | v39.05,62.87 IC1.6 31.43,62.87 30.16,61.59 R5.1 | IC2.7 v67.94,78.11 | v106.05,18.41 106.05,13.97 104.78,12.7 IC3.1
CS_0
  Bottom 0.406: IC9.15 146.05,19.68 151.13,24.77 SV2.57
CS_2
  Bottom 0.406: IC9.13 146.69,14.61 154.31,22.23 SV2.59
CS_3
  Bottom 0.406: SV2.60 156.84,20.95 154.31,20.95 145.41,12.06 IC9.12
CS_4
  Bottom 0.406: IC9.11 146.05,9.53 147.32,10.79 147.32,12.7 154.31,19.68 SV2.61
CS_5
  Bottom 0.406: SV2.62 156.84,18.41 156.84,16.19 156.21,15.56 152.72,15.56 149.22,12.06 149.22,7.62 146.05,4.45 IC9.9
CS_6
  Bottom 0.406: IC9.10 146.05,6.99 148.27,9.21 148.27,12.38 153.03,17.14 SV2.63
CS_EPROM  (via drill 0.6 pad 1.42)
  Top 0.406: v122.56,19.68 v122.56,70.48
  Bottom 0.406: U$3.20 120.65,71.75 121.92,70.48 v122.56,70.48 | v122.56,19.68 IC3.13
CS_RAM1  (via drill 0.6 pad 1.42)
  Top 0.406: v88.9,17.78 v88.9,70.48
  Bottom 0.406: v88.9,70.48 80.64,70.48 79.38,71.75 U$4.20 | IC3.19 107.31,13.97 106.05,12.7 106.05,6.99 105.41,6.35 93.98,6.35 88.9,11.43 v88.9,17.78
CS_RAM2  (via drill 0.6 pad 1.42)
  Top 0.406: v109.86,19.68 v109.86,70.48
  Bottom 0.406: v109.86,70.48 100.97,70.48 99.69,71.75 U$2.20 | IC3.18 v109.86,19.68
D0  (via drill 0.6 pad 1.42)
  Top 0.406: v146.69,76.83 v146.69,84.45 | v53.02,76.83 v53.02,74.3 | v35.24,75.56 v35.24,83.19 | v108.58,76.83 v108.58,92.71 | v12.7,83.19 v12.7,33.02
  Bottom 0.406: v146.69,76.83 U$3.11 121.92,76.83 120.65,78.11 116.84,78.11 115.57,76.83 U$2.11 v108.58,76.83 100.97,76.83 99.69,78.11 96.52,78.11 95.25,76.83 U$4.11 80.64,76.83 79.38,78.11 71.44,78.11 70.17,76.83 v53.02,76.83 | SV2.7 150.5,88.27 v146.69,84.45 | v53.02,74.3 51.75,74.3 50.48,75.56 IC2.35 v35.24,75.56 | v35.24,83.19 IC1.14 25.4,83.19 24.13,84.45 15.88,84.45 14.61,83.19 v12.7,83.19 | IC6.3 113.98,95.57 111.12,92.71 v108.58,92.71 | v12.7,33.02 15.24,33.02 19.68,28.57 IC11.4
D1  (via drill 0.6 pad 1.42)
  Top 0.406: v148.59,79.38 v148.59,84.45 | v36.51,78.11 v36.51,85.72 | v106.05,90.17 v106.05,79.38 | v51.75,78.11 v51.75,40.64 | v81.28,79.38 v81.28,36.83
  Bottom 0.406: v148.59,79.38 U$3.12 121.92,79.38 120.65,80.64 116.84,80.64 115.57,79.38 U$2.12 v106.05,79.38 100.97,79.38 99.69,80.64 96.52,80.64 95.25,79.38 U$4.12 v81.28,79.38 | SV2.8 156.84,87 151.13,87 v148.59,84.45 | v36.51,78.11 IC2.34 v51.75,78.11 | v36.51,85.72 IC1.15 | IC6.4 116.52,94.93 111.76,90.17 v106.05,90.17 | IC11.3 24.13,27.3 30.16,33.34 30.16,36.07 31.43,37.34 48.45,37.34 v51.75,40.64 64.14,40.64 66.67,38.1 80.01,38.1 v81.28,36.83
D2  (via drill 0.6 pad 1.42)
  Top 0.406: v150.81,81.92 v150.81,84.45 | v71.12,85.72 v71.12,81.92 | v124.14,85.72 v124.14,81.92 | v11.43,76.83 v11.43,31.43
  Bottom 0.406: SV2.9 152.08,85.72 v150.81,84.45 | v71.12,81.92 51.12,81.92 49.85,80.64 IC2.33 36.51,80.64 33.97,78.11 IC1.12 31.43,78.11 30.16,76.83 v11.43,76.83 | v150.81,81.92 U$3.13 v124.14,81.92 121.92,81.92 120.65,83.19 116.84,83.19 115.57,81.92 U$2.13 100.97,81.92 99.69,83.19 96.52,83.19 95.25,81.92 U$4.13 80.64,81.92 79.38,83.19 75.56,83.19 73.03,85.72 v71.12,85.72 | IC6.7 v124.14,85.72 | v11.43,31.43 15.56,31.43 20.95,26.04 IC11.2
D3  (via drill 0.6 pad 1.42)
  Top 0.406: v41.59,67.94 v41.59,83.19 | v51.75,83.19 v51.75,87 | v25.4,66.67 v25.4,38.1
  Bottom 0.406: 126.68,83.19 121.92,83.19 120.65,84.45 U$3.15 116.84,84.45 115.57,83.19 100.97,83.19 99.69,84.45 U$2.15 96.52,84.45 95.25,83.19 80.64,83.19 79.38,84.45 U$4.15 76.2,84.45 73.66,87 v51.75,87 | SV2.10 156.84,84.45 153.35,84.45 152.08,83.19 126.68,83.19 | v41.59,67.94 IC1.8 31.43,67.94 30.16,66.67 v25.4,66.67 | v51.75,83.19 IC2.32 v41.59,83.19 | IC6.8 126.68,83.19 | v25.4,38.1 25.4,35.88 24.45,34.92 IC11.9
D4  (via drill 0.6 pad 1.42)
  Top 0.406: v39.05,65.41 v39.05,85.72 | v125.41,84.45 v125.41,80.64 | v26.67,64.14 v26.67,39.37
  Bottom 0.406: SV2.11 153.99,83.19 151.45,80.64 v125.41,80.64 121.92,80.64 120.65,81.92 U$3.16 116.84,81.92 115.57,80.64 100.97,80.64 99.69,81.92 U$2.16 96.52,81.92 95.25,80.64 80.64,80.64 79.38,81.92 U$4.16 74.93,81.92 72.39,84.45 53.66,84.45 52.39,85.72 IC2.31 v39.05,85.72 | v39.05,65.41 IC1.7 31.43,65.41 30.16,64.14 v26.67,64.14 | IC6.13 126.68,101.28 125.41,100.01 v125.41,84.45 | v26.67,39.37 26.67,35.56 24.77,33.66 IC11.8
D5  (via drill 0.6 pad 1.42)
  Top 0.406: v44.13,79.38 v44.13,90.81 | v40.32,70.48 v40.32,79.38 | v122.87,84.45 v122.87,78.11 | v27.94,69.22 v27.94,38.1
  Bottom 0.406: SV2.12 156.84,81.92 153.99,81.92 150.18,78.11 v122.87,78.11 121.92,78.11 120.65,79.38 U$3.17 116.84,79.38 115.57,78.11 100.97,78.11 99.69,79.38 U$2.17 96.52,79.38 95.25,78.11 80.64,78.11 79.38,79.38 U$4.17 v44.13,79.38 v40.32,79.38 | v40.32,70.48 IC1.9 31.43,70.48 30.16,69.22 v27.94,69.22 | IC2.29 v44.13,90.81 | IC6.14 124.14,101.28 122.87,100.01 v122.87,84.45 | v27.94,38.1 27.94,34.92 25.4,32.38 IC11.7
D6  (via drill 0.6 pad 1.42)
  Top 0.406: v74.3,92.08 v74.3,76.83 | v37.78,73.03 v37.78,93.34 | v111.12,91.44 v111.12,75.56 | v24.13,71.75 v24.13,39.37
  Bottom 0.406: SV2.13 153.99,80.64 148.91,75.56 v126.68,75.56 121.92,75.56 120.65,76.83 U$3.18 116.84,76.83 115.57,75.56 v111.12,75.56 100.97,75.56 99.69,76.83 U$2.18 96.52,76.83 95.25,75.56 80.64,75.56 79.38,76.83 U$4.18 v74.3,76.83 | v37.78,73.03 IC1.10 31.43,73.03 30.16,71.75 v24.13,71.75 | v37.78,93.34 IC2.28 61.91,93.34 63.18,92.08 v74.3,92.08 | IC6.17 116.52,100.97 115.25,99.69 115.25,95.57 v111.12,91.44 | IC11.6 26.04,31.11 29.21,34.29 29.21,39.37 27.94,40.64 25.4,40.64 v24.13,39.37
D7  (via drill 0.6 pad 1.42)
  Top 0.406: v59.69,94.61 v59.69,74.3 | v40.32,95.89 v40.32,81.92 | v109.86,93.98 v109.86,73.03 | v13.97,81.92 v13.97,34.29
  Bottom 0.406: SV2.14 156.84,79.38 153.99,79.38 147.64,73.03 121.92,73.03 120.65,74.3 U$3.19 116.84,74.3 115.57,73.03 v109.86,73.03 100.97,73.03 99.69,74.3 U$2.19 96.52,74.3 95.25,73.03 80.64,73.03 79.38,74.3 U$4.19 v59.69,74.3 | v40.32,95.89 IC2.27 55.24,95.89 56.52,94.61 v59.69,94.61 | v40.32,81.92 35.88,81.92 34.61,80.64 IC1.13 31.75,80.64 30.48,81.92 v13.97,81.92 | IC6.18 113.98,100.97 112.71,99.69 112.71,95.57 111.12,93.98 v109.86,93.98 | IC11.5 19.68,29.84 15.24,34.29 v13.97,34.29
DMA_CS  (via drill 0.6 pad 1.42)
  Top 0.406: v87.63,100.97 v87.63,30.48 | v142.24,29.53 v142.24,17.14
  Bottom 0.406: IC2.16 v87.63,100.97 | v87.63,30.48 120.97,30.48 123.19,28.26 124.46,28.26 125.73,29.53 v142.24,29.53
  Bottom 0.61: v142.24,17.14 IC9.14
DMA_RDY  (via drill 0.6 pad 1.42)
  Top 0.406: v85.72,95.89 v85.72,36.2
  Bottom 0.406: IC2.25 54.61,100.97 57.47,98.11 61.91,98.11 62.87,97.16 66.36,97.16 67.63,95.89 v85.72,95.89 | SV2.40 156.84,46.35 153.99,46.35 140.34,32.7 124.14,32.7 121.92,34.92 93.34,34.92 92.08,36.2 v85.72,36.2
GND  (via drill 0.6 pad 1.42)
  Top 0.61: v134.3,94.93 v134.3,87.63 | v92.39,118.75 v92.39,113.67 | v39.05,88.9 v39.05,113.67 | v102.23,1.91 v102.23,8.26 | v4.13,41.91 v8.57,41.91 | v136.84,46.99 v136.84,27.94 | v4.13,78.11 v8.57,78.11 | v111.7,21.79 v111.7,26.56 | v99.06,99.06 v99.06,118.75
  Bottom 0.406: CON1.1 67.31,16.51 58.42,16.51 | CON1.8 58.42,16.51 | CON1.9 57.15,16.51 | CON1.17 46.99,17.46 46.67,17.14 | CON1.39 50.16,16.51 | CON1.14 50.8,16.51 | CON1.15 49.53,16.51 50.16,16.51 | CON1.10 55.88,16.51 | CON1.11 54.61,16.51 | CON1.12 53.34,16.51 | 50.16,16.51 50.8,16.51 | 50.8,16.51 53.34,16.51 | 53.34,16.51 54.61,16.51 | 54.61,16.51 55.88,16.51 | 55.88,16.51 57.15,16.51 | 57.15,16.51 58.42,16.51 | 48.58,17.14 48.26,17.46 CON1.16 48.26,25.4 48.9,26.04 | CON1.50 33.07,21.32 33.02,21.27
  pour Bottom (isolate 0.406, no thermals): 0,122.56 0,0 167.64,0 167.64,122.56
HALT  (via drill 0.6 pad 1.42)
  Top 0.406: v91.44,86.68 v91.44,34.92
  Bottom 0.406: SV2.41 153.99,45.09 140.65,31.75 123.83,31.75 121.6,33.97 92.39,33.97 v91.44,34.92 | IC1.18 34.61,93.34 36.83,91.12 41.91,91.12 43.5,89.53 73.66,89.53 76.52,86.68 v91.44,86.68
IEO  (via drill 0.6 pad 1.42)
  Top 0.406: v72.97,71.69 v72.97,98.28 | v137.57,101.6 v112.32,101.6
  Bottom 0.406: IC2.36 50.51,73.03 51.85,71.69 v72.97,71.69 | v72.97,98.28 87.49,98.28 90.81,101.6 v112.32,101.6 | SV2.2 156.84,94.61 144.56,94.61 v137.57,101.6
INT  (via drill 0.6 pad 1.42)
  Top 0.406: v29.21,47.62 v29.21,86.04 | v46.67,70.48 v46.67,87
  Bottom 0.406: SV2.32 156.84,56.52 153.99,56.52 138.75,41.27 93.34,41.27 92.08,42.55 67.94,42.55 65.09,45.4 36.52,45.4 34.3,47.62 v29.21,47.62 | v46.67,87 34.92,87 33.66,88.27 IC1.16
  Bottom 0.61: R2.1 28.41,86.84 v29.21,86.04 | IC2.37 v46.67,70.48
  Bottom 0.813: IC1.16 R2.1
INTA  (via drill 0.6 pad 1.42)
  Top 0.406: v125.09,19.68 v125.09,40.01
  Bottom 0.406: IC3.12 v125.09,19.68 | v125.09,40.01 138.75,40.01 153.99,55.24 SV2.33
LOCAL_IO_CS
  Bottom 0.406: IC9.7 132.08,6.99 128.91,10.16 125.73,10.16 125.09,9.53 IC3.9
M1  (via drill 0.6 pad 1.42)
  Top 0.406: v23.5,94.61 v23.5,83.19 | v100.33,93.34 v100.33,5.08 | v107.31,12.06 v133.03,12.06 | v151.13,22.86 v151.13,38.1
  Bottom 0.406: v23.5,94.61 15.88,94.61 14.61,95.89 14.61,100.01 15.88,101.28 33.66,101.28 36.51,98.42 IC2.26 54.29,98.42 56.52,96.2 61.28,96.2 62.87,94.61 65.72,94.61 66.99,93.34 v100.33,93.34 | v100.33,5.08 105.41,5.08 107.31,6.99 IC3.2 v107.31,12.06 | IC9.6 134.3,9.53 133.03,10.79 v133.03,12.06 133.03,14.29 134.62,15.88 139.06,15.88 141.6,18.41 146.69,18.41 v151.13,22.86 | SV2.43 153.92,42.55 151.13,39.76 v151.13,38.1
  Bottom 0.813: v23.5,83.19 IC1.27
N$1
  Bottom 0.61: QG1.1 R10.1
N$2
  Bottom 0.61: JP1.2 R15.1
N$3  (via drill 0.6 pad 1.42)
  Top 0.406: v54.61,67.94 v54.61,39.37
  Bottom 0.406: IC2.38 v54.61,67.94 | v54.61,39.37 64.14,39.37 66.67,36.83 R16.1
N$5
  Bottom 0.813: IC6.16 R11.1
N$8
  Bottom 0.813: R6.2 LED3.K
N$9
  Bottom 0.813: R11.2 LED4.K
N$10
  Bottom 0.813: IC6.19 R6.1
N$11
  Bottom 0.406: CON1.44 43.81,19.05 41.27,16.51 26.67,16.51 R8.1
N$12
  Bottom 0.406: CON1.36 53.98,27.94 56.11,30.07 R7.1
N$13
  Bottom 0.406: CON1.46 41.27,19.05 40.64,18.41 26.35,18.41 R1.1
N$15
  Bottom 0.61: LED1.A R13.1
N$16  (via drill 0.6 pad 1.42)
  Top 0.406: v25.4,17.46 v15.24,17.46
  Bottom 0.406: CON1.45 42.55,19.05 40.96,17.46 v25.4,17.46
  Bottom 0.813: LED1.K v15.24,17.46
N$23  (via drill 0.6 pad 1.27)
  other vias: 5,117.39
N$24  (via drill 0.6 pad 1.27)
  other vias: 162.48,5
N$25  (via drill 0.6 pad 1.27)
  other vias: 162.48,117.39
N$29
  Bottom 0.406: CON1.32 59.05,26.35 R12.1
N$37  (via drill 0.6 pad 1.27)
  other vias: 5,5
NMI  (via drill 0.6 pad 1.42)
  Top 0.406: v30.48,46.35 v30.48,90.81
  Bottom 0.406: SV2.39 153.99,47.62 140.02,33.66 124.46,33.66 122.24,35.88 93.66,35.88 92.08,37.47 83.82,37.47 81.28,40.01 67.31,40.01 64.45,42.86 33.97,42.86 v30.48,46.35
  Bottom 0.813: IC1.17 v30.48,90.81 R3.1
OUT_1
  Bottom 0.406: SV2.3 131.76,93.34 130.49,94.61 130.49,100.01 129.22,101.28 IC6.12
OUT_2  (via drill 0.6 pad 1.42)
  Top 0.406: v131.44,92.08 v127.95,92.08
  Bottom 0.406: SV2.4 156.84,92.08 v131.44,92.08 | v127.95,92.08 127.95,107 127,107.95 122.56,107.95 121.6,107 IC6.15
OUT_3
  Bottom 0.406: SV2.5 130.81,90.81 129.22,92.39 IC6.9
OUT_4  (via drill 0.6 pad 1.42)
  Top 0.406: v127.95,89.53 v119.06,89.53
  Bottom 0.406: SV2.6 156.84,89.53 v127.95,89.53 | v119.06,89.53 IC6.5
PORT_CS  (via drill 0.6 pad 1.42)
  Top 0.406: v116.2,89.53 v116.2,19.68
  Bottom 0.406: IC6.11 131.76,107.63 130.49,108.9 122.24,108.9 120.33,107 120.33,102.23 117.79,99.69 117.79,94.93 116.2,93.34 v116.2,89.53 | v116.2,19.68 116.2,18.41 117.47,17.14 IC3.15
RD  (via drill 0.6 pad 1.42)
  Top 0.406: v126.36,65.41 v126.36,38.73 | v69.22,66.67 v69.22,83.19 | v15.24,87 v15.24,29.84 | v57.78,24.96 68.77,24.96 71.12,27.3 v71.12,66.67
  Bottom 0.406: v126.36,65.41 121.92,65.41 120.65,66.67 U$3.22 116.84,66.67 115.57,65.41 100.97,65.41 99.69,66.67 U$2.22 96.52,66.67 95.25,65.41 80.64,65.41 79.38,66.67 U$4.22 v69.22,66.67 | v126.36,38.73 138.75,38.73 153.99,53.98 156.84,53.98 SV2.34 | IC1.21 25.72,98.42 26.99,97.16 26.99,86.36 | v69.22,83.19 IC2.9 53.66,83.19 52.39,84.45 28.89,84.45 26.99,86.36 | 26.99,86.36 22.54,86.36 21.91,87 v15.24,87 | IC11.1 20.95,24.77 15.88,29.84 v15.24,29.84 | CON1.34 56.52,23.69 v57.78,24.96
  Bottom 0.61: v69.22,66.67 v71.12,66.67
ROM_SHADOW  (via drill 0.6 pad 1.42)
  Top 0.406: v121.28,85.72 v121.28,18.41
  Bottom 0.406: IC6.6 121.6,86.04 v121.28,85.72 | v121.28,18.41 121.28,10.79 120.02,9.53 IC3.7
VCC  (via drill 0.6 pad 1.42, 0.6 pad 1.68, 0.6 pad 1.78)  (1 unrouted)
  Top 0.406: v22.86,74.3 v22.86,61.59
  Top 0.61: v66.99,88.27 v66.99,116.2 | v27.94,74.3 v27.94,109.22 | v25.57,96.52 v25.57,109.22 | v95.89,49.53 v95.89,116.2 | v50.16,24.45 v17.78,24.45 | v102.23,116.2 v102.23,24.13
  Bottom 0.406: CON1.38 51.44,24.42 C7.1 52.07,24.47 CON1.13 | R12.2 R7.2 | v22.86,61.59 R5.2
  Bottom 0.61: C18.1 IC2.11 v66.99,88.27 | IC1.11 31.43,75.56 30.16,74.3 v27.94,74.3 C5.1 v22.86,74.3 | U$3.1 U$3.28 | v50.16,24.45 C7.1 | IC11.20 31.75,24.77 30.16,23.18 26.04,23.18 | 26.04,23.18 17.78,23.18 | C22.1 26.02,22.85 26.04,23.18 | 6.35,46.35 QG1.14 18.41,46.35 19.68,45.09 R10.2 | v102.23,24.13 | R12.2 71.44,24.13 v102.23,24.13 | R13.2 17.46,14.92 17.78,14.61 | D1.C 6.03,88.58 6.35,88.27 | R7.2 R16.2
  Bottom 0.813: R4.2 R2.2 R3.2 | v25.57,96.52 R3.2 | C12.1 QG1.14 | R17.2 R3.2
  Bottom 1.016: U$3.28 U$3.27 | C9.1 IC6.20 108.9,115.89 109.22,116.2
  Bottom 1.27: U$2.28 C2.1 | U$4.28 C1.1 v95.89,49.53 | U$3.28 C3.1 98.45,49.51 C2.1 | C2.1 | IC9.16 C13.1 v102.23,24.13 | v95.89,49.53 | C2.1 v95.89,49.53 | C23.+ 17.78,14.61 R8.2 R1.2 17.78,23.18 v17.78,24.45 JP3.1 10.48,26.99 6.35,31.11 6.35,46.35 R14.2 6.35,88.27 6.35,102.87 12.7,109.22 v25.57,109.22 v27.94,109.22 | IC3.20 C14.1 v102.23,24.13 | v102.23,24.13 | 109.22,116.2 LED3.A LED4.A C10.+ | v27.94,109.22 39.05,109.22 46.04,116.2 v66.99,116.2 v95.89,116.2 v102.23,116.2 108.9,116.2 108.9,115.89 | v27.94,109.22 C16.+
WAIT  (via drill 0.6 pad 1.42)
  Top 0.406: v19.68,47.62 v19.68,90.81
  Bottom 0.406: SV2.42 156.84,43.81 153.99,43.81 140.97,30.8 123.51,30.8 121.28,33.02 87,33.02 80.96,39.05 66.99,39.05 64.14,41.91 33.02,41.91 27.3,47.62 v19.68,47.62
  Bottom 0.61: IC1.24 v19.68,90.81 R17.1
WR  (via drill 0.6 pad 1.42)
  Top 0.406: v111.12,52.7 v111.12,40.01 | v66.67,53.98 v66.67,80.64 | v53.34,80.64 v53.34,97.16 | v56.49,27.3 v56.52,52.7 | v113.67,19.68 v113.67,40.01
  Bottom 0.406: SV2.35 153.99,52.7 138.75,37.47 125.73,37.47 123.19,40.01 v113.67,40.01 v111.12,40.01 | v53.34,97.16 36.51,97.16 33.34,100.33 16.19,100.33 15.56,99.69 15.56,96.52 16.19,95.89 IC1.22 | v53.34,80.64 IC2.8 | v56.49,27.3 56.49,25.2 55.24,23.95 CON1.35 | v56.52,52.7 65.41,52.7 v66.67,53.98 U$4.27 79.38,53.98 80.64,52.7 95.25,52.7 96.52,53.98 U$2.27 99.69,53.98 100.97,52.7 v111.12,52.7 | IC3.4 112.39,9.53 113.67,10.79 v113.67,19.68
  Bottom 0.61: IC2.8 v66.67,80.64